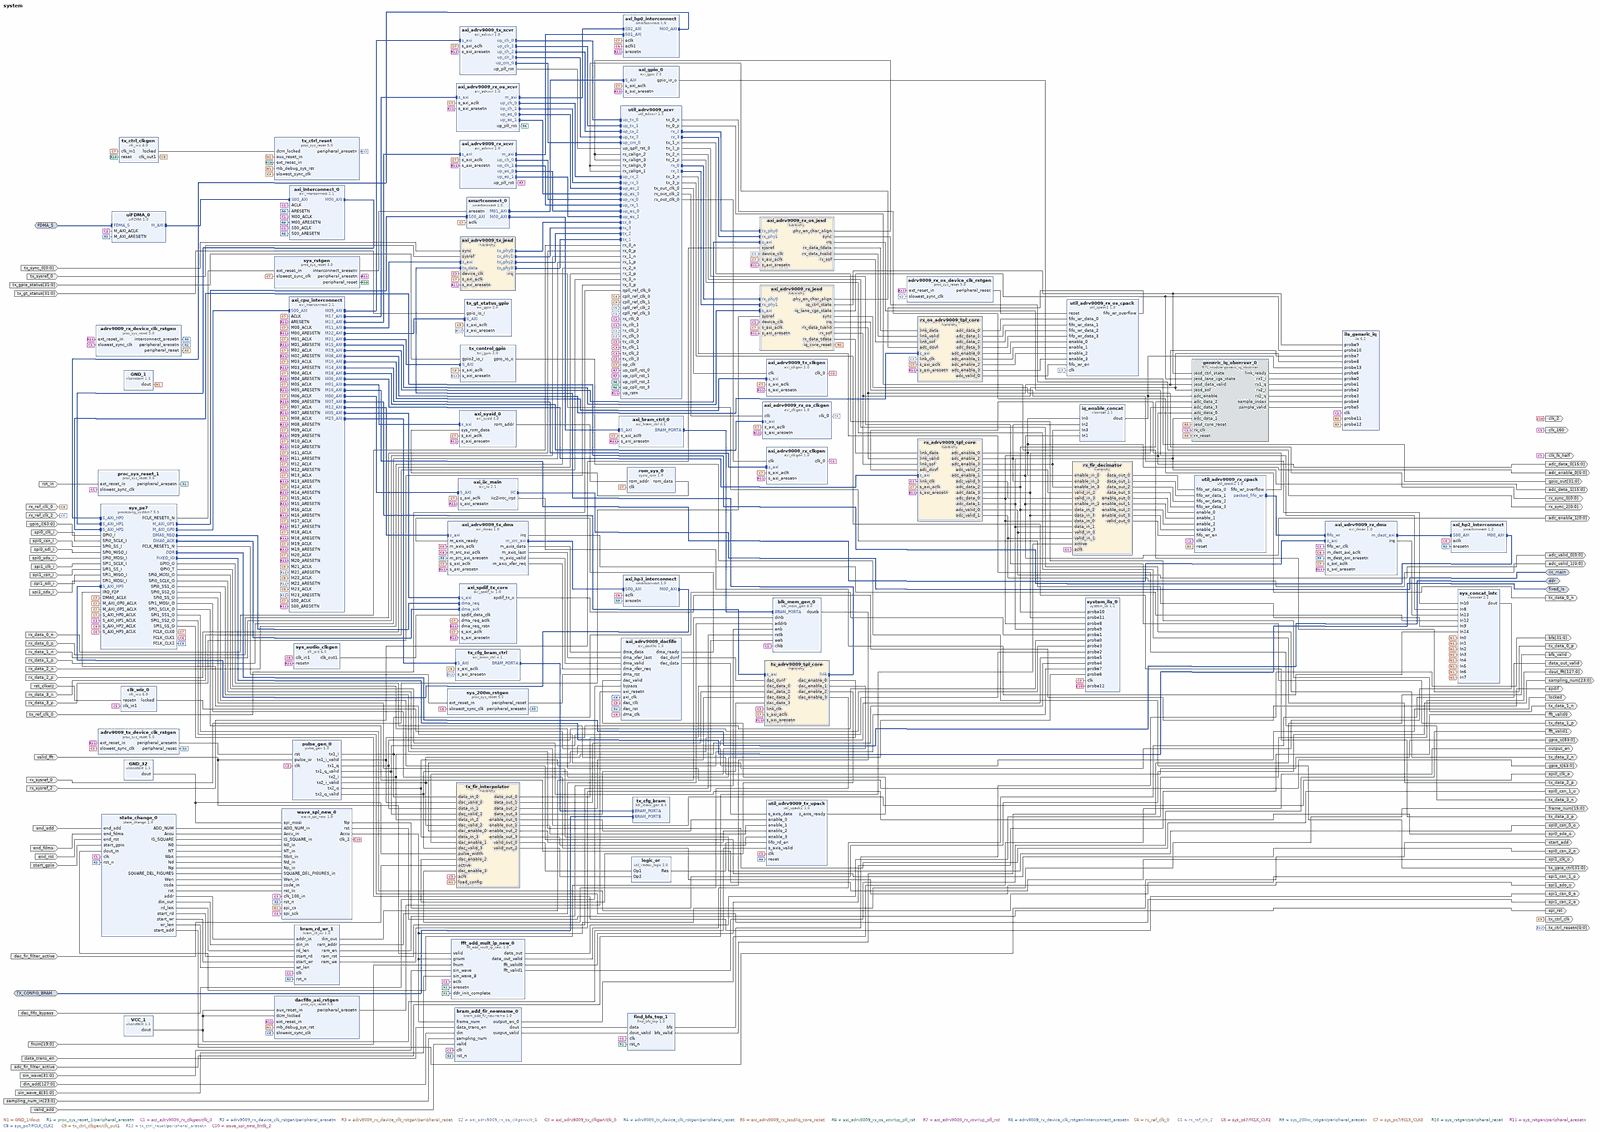
[diagram p0: block diagram of the top level, whole]
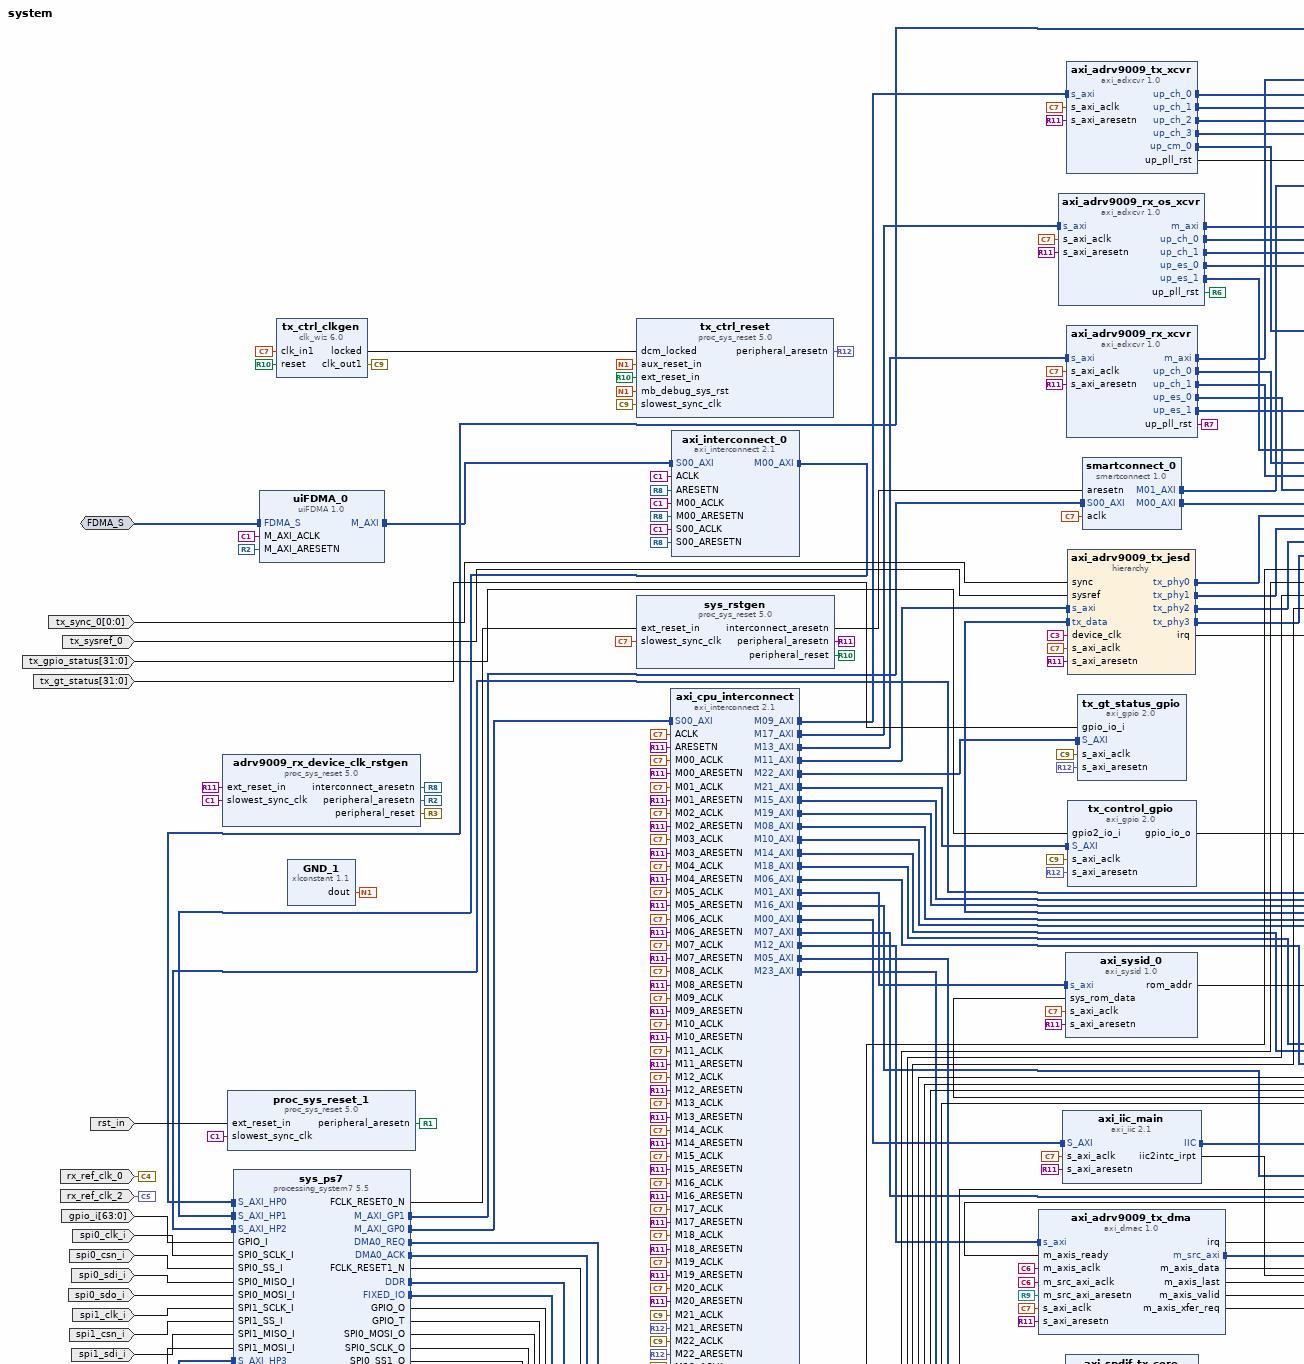
[diagram p1: block diagram of the top level, upper left part]
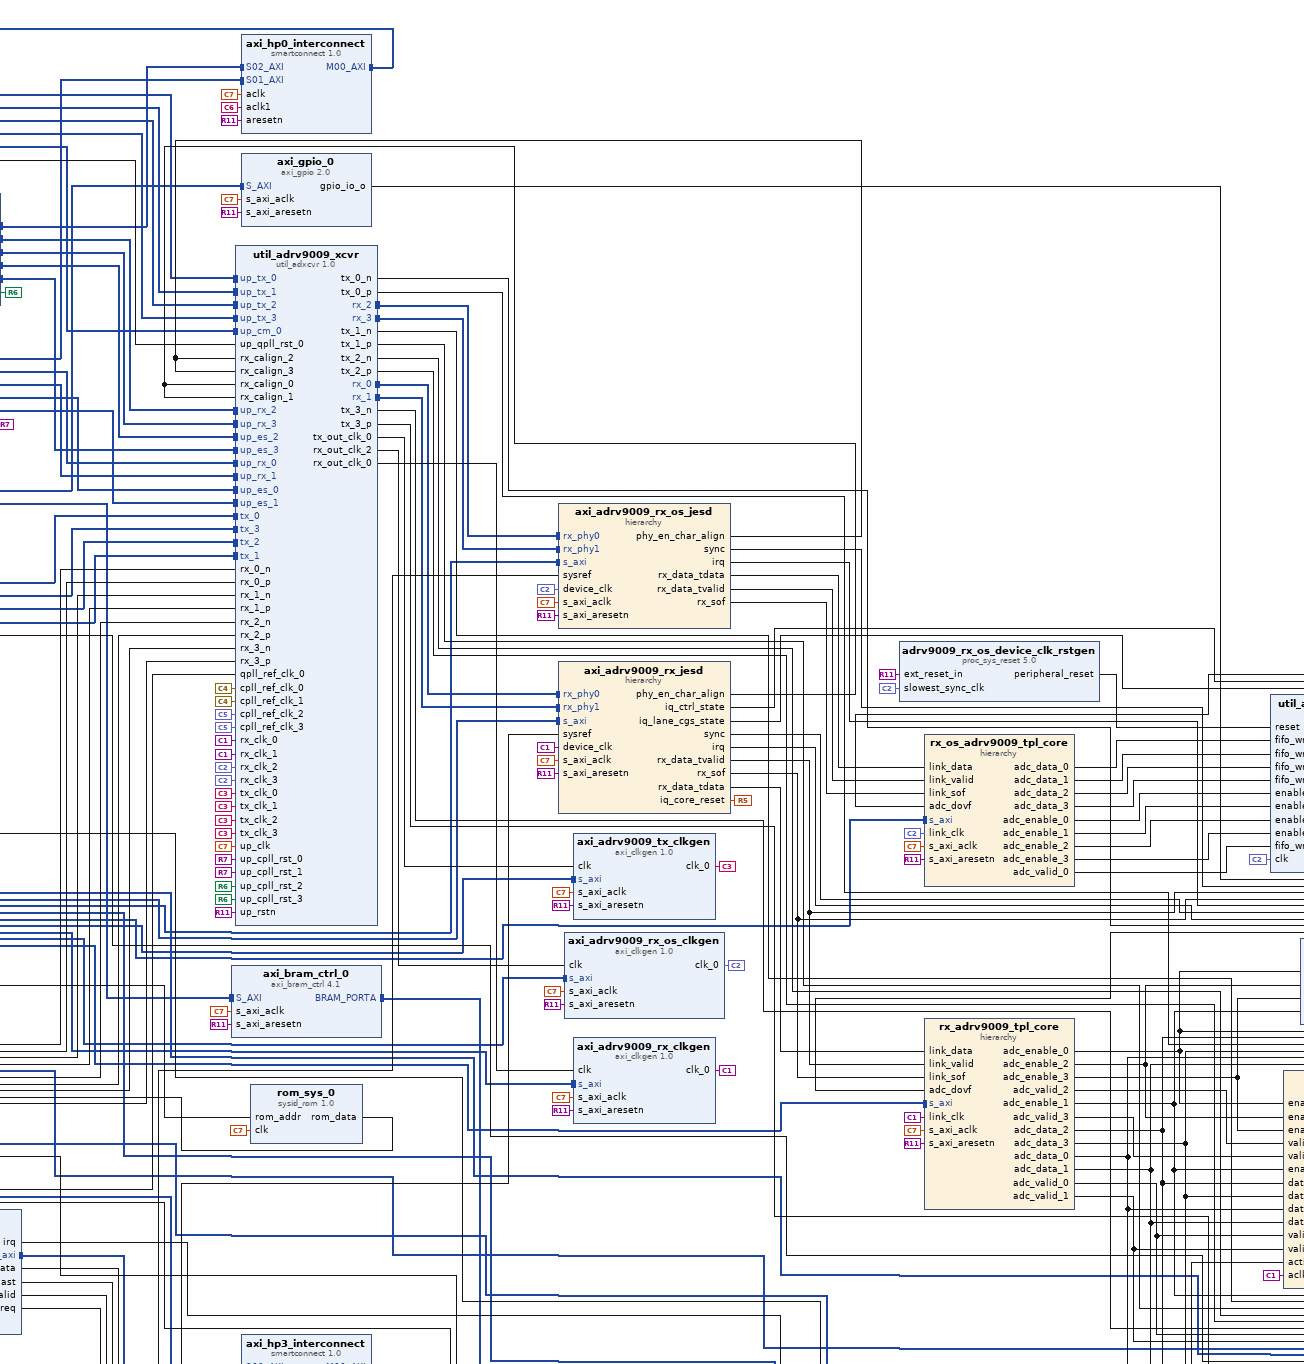
[diagram p2: block diagram of the top level, upper centre part]
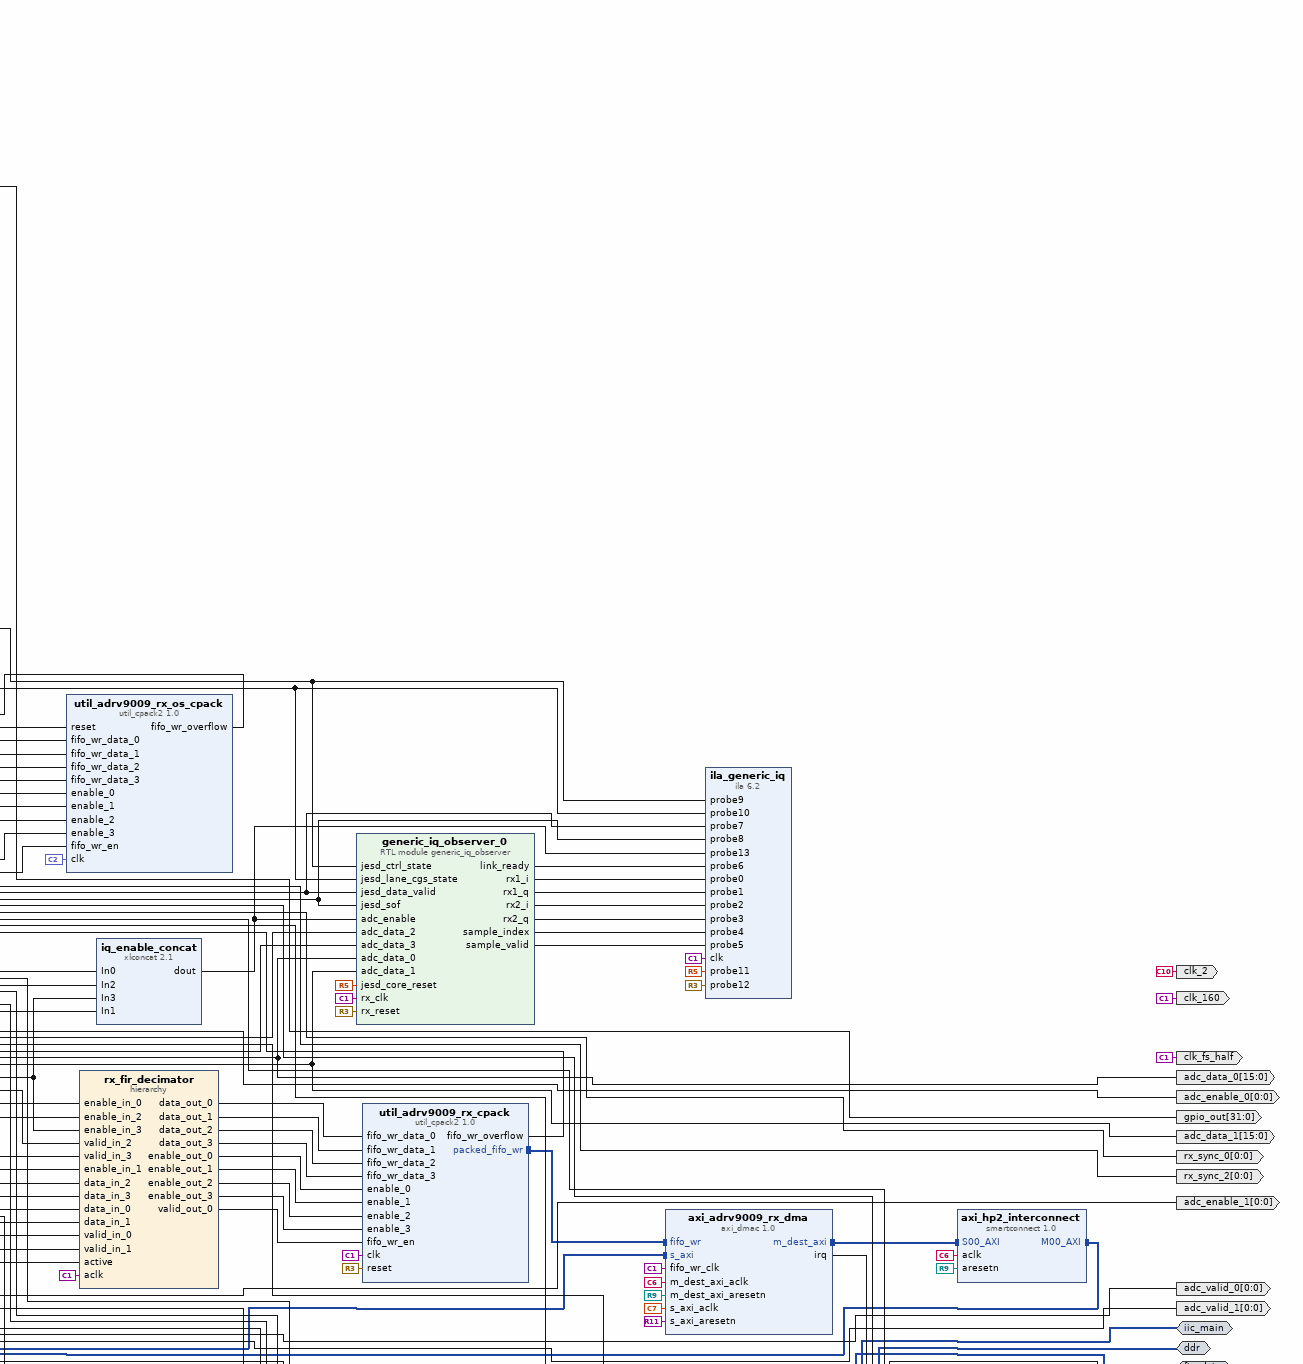
[diagram p3: block diagram of the top level, upper right part]
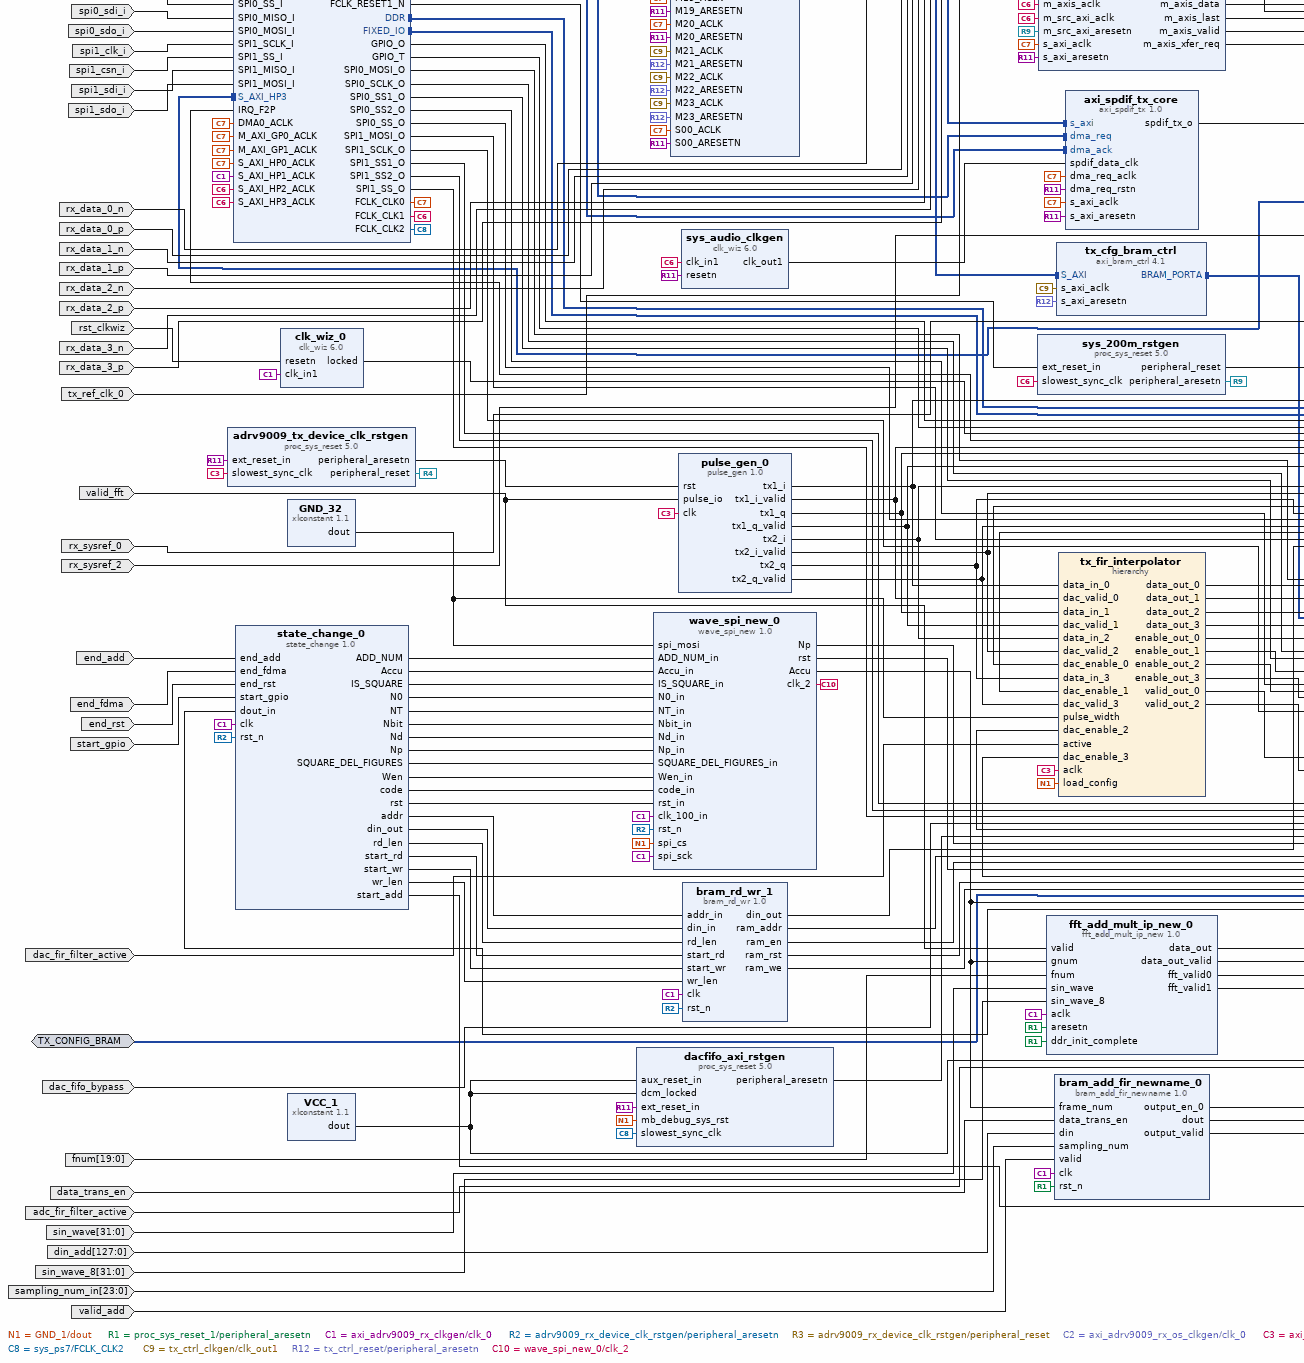
[diagram p4: block diagram of the top level, lower left part]
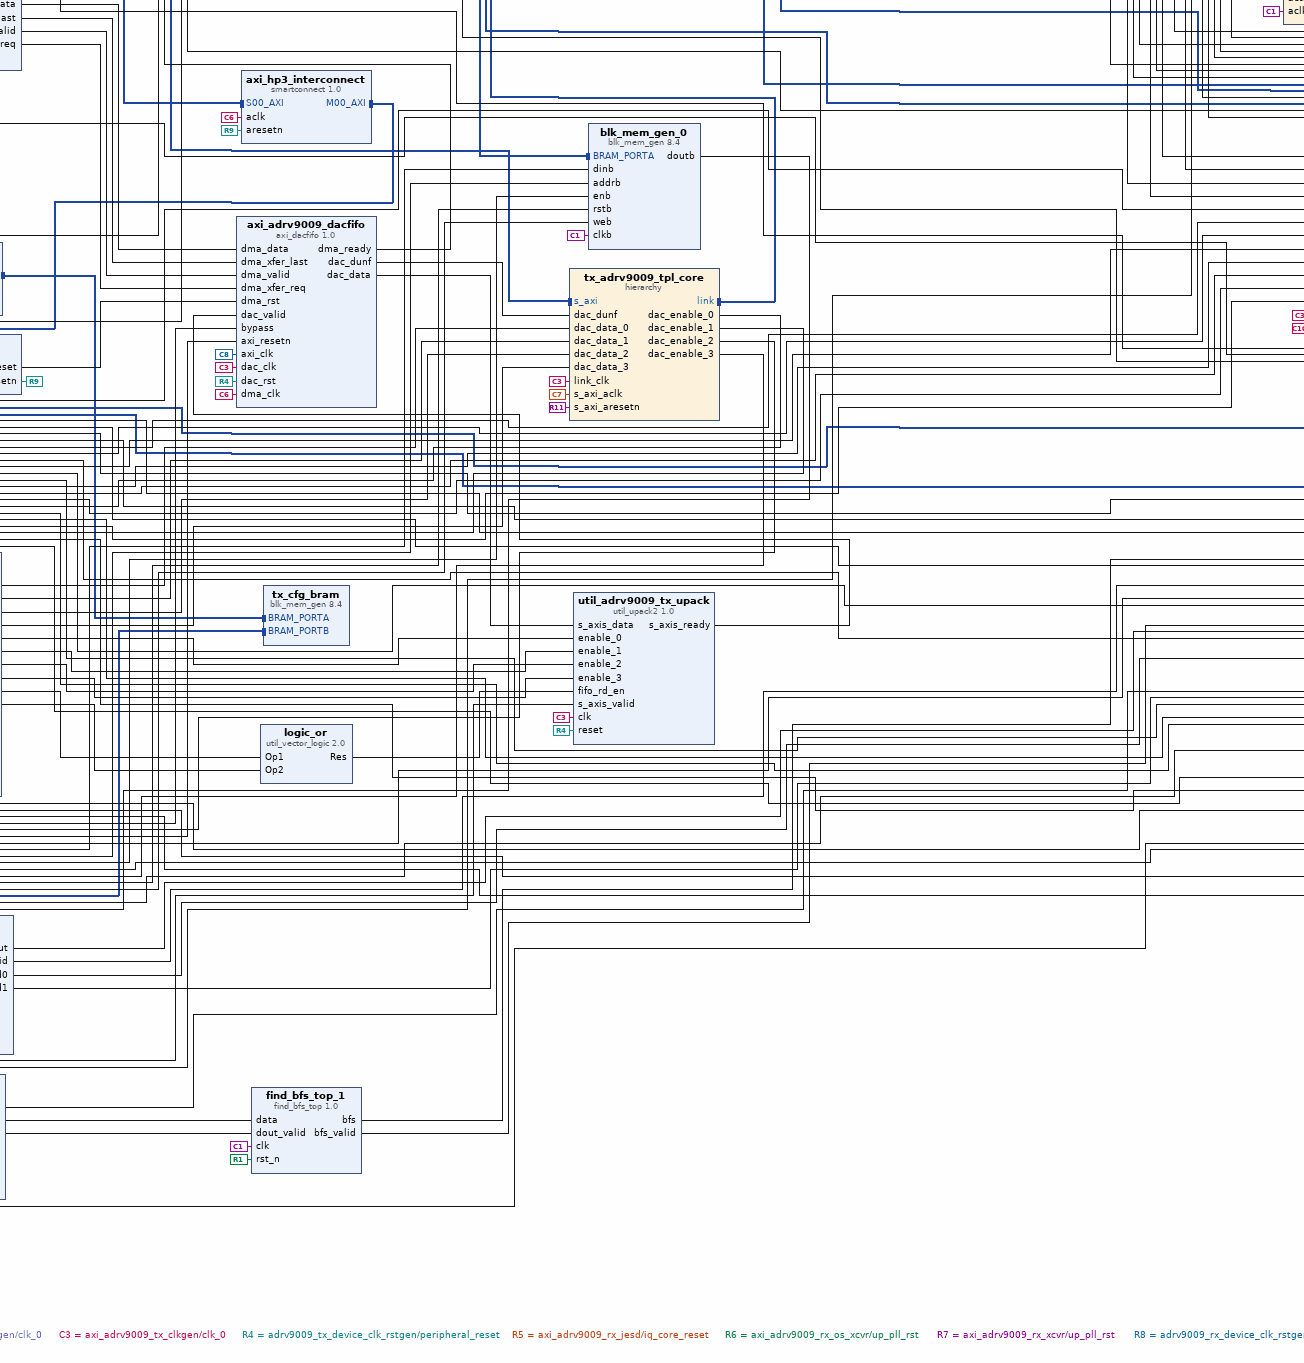
[diagram p5: block diagram of the top level, lower centre part]
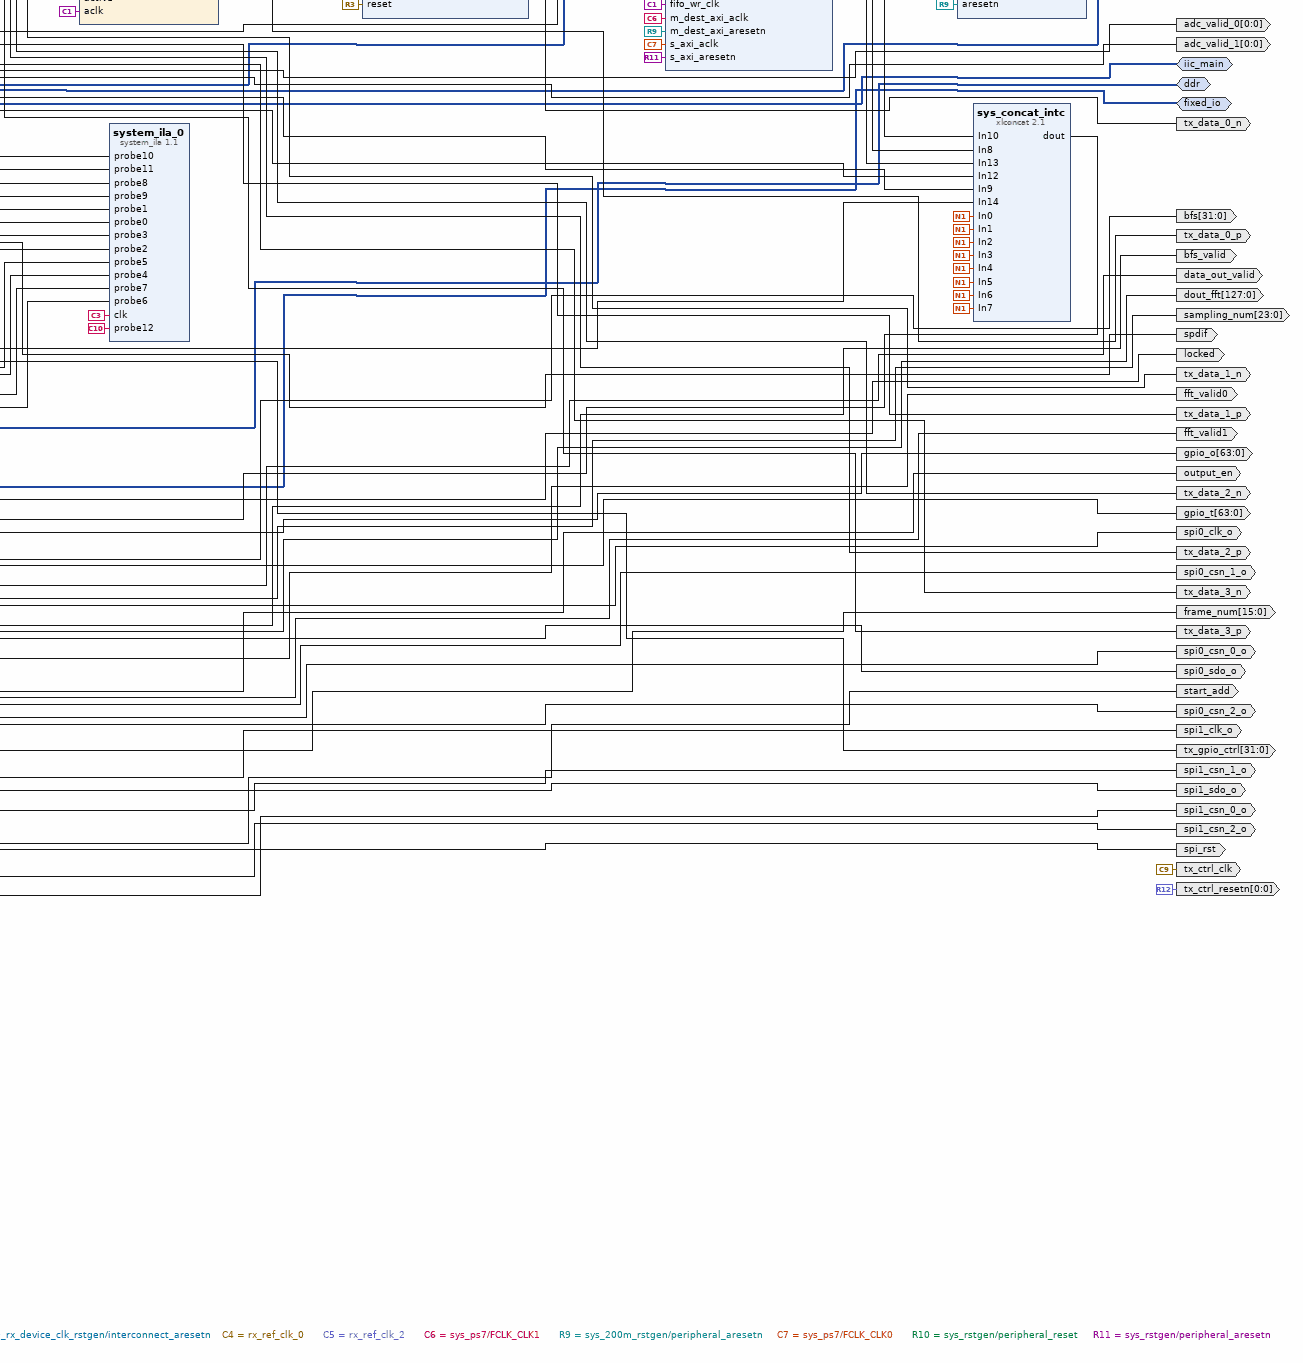
[diagram p6: block diagram of the top level, lower right part]
# Vivado block design system, xc7z100ffg900-2, Vivado 2022.2
create_bd_design system

create_bd_intf_port -mode Master -vlnv xilinx.com:interface:ddrx_rtl:1.0 ddr
create_bd_intf_port -mode Master -vlnv xilinx.com:interface:iic_rtl:1.0 iic_main
create_bd_intf_port -mode Master -vlnv xilinx.com:display_processing_system7:fixedio_rtl:1.0 fixed_io
create_bd_intf_port -mode Slave -vlnv xilinx.com:user:FDMA_rtl:1.0 FDMA_S
create_bd_intf_port -mode Slave -vlnv xilinx.com:interface:bram_rtl:1.0 TX_CONFIG_BRAM
set_property -dict {CONFIG.MASTER_TYPE BRAM_CTRL} [get_bd_intf_ports TX_CONFIG_BRAM]
create_bd_port -dir O spi0_csn_2_o
create_bd_port -dir O spi0_csn_1_o
create_bd_port -dir O spi0_csn_0_o
create_bd_port -dir I spi0_csn_i
create_bd_port -dir I spi0_clk_i
create_bd_port -dir O spi0_clk_o
create_bd_port -dir I spi0_sdo_i
create_bd_port -dir O spi0_sdo_o
create_bd_port -dir I spi0_sdi_i
create_bd_port -dir O spi1_csn_2_o
create_bd_port -dir O spi1_csn_1_o
create_bd_port -dir O spi1_csn_0_o
create_bd_port -dir I spi1_csn_i
create_bd_port -dir I spi1_clk_i
create_bd_port -dir O spi1_clk_o
create_bd_port -dir I spi1_sdo_i
create_bd_port -dir O spi1_sdo_o
create_bd_port -dir I spi1_sdi_i
create_bd_port -dir I -from 63 -to 0 gpio_i
create_bd_port -dir O -from 63 -to 0 gpio_o
create_bd_port -dir O -from 63 -to 0 gpio_t
create_bd_port -dir I adc_fir_filter_active
create_bd_port -dir I dac_fir_filter_active
create_bd_port -dir I tx_ref_clk_0
create_bd_port -dir I rx_ref_clk_0
create_bd_port -dir I rx_ref_clk_2
create_bd_port -dir I tx_sysref_0
create_bd_port -dir I -from 0 -to 0 tx_sync_0
create_bd_port -dir O tx_data_0_p
create_bd_port -dir O tx_data_0_n
create_bd_port -dir O tx_data_1_p
create_bd_port -dir O tx_data_1_n
create_bd_port -dir O tx_data_2_p
create_bd_port -dir O tx_data_2_n
create_bd_port -dir O tx_data_3_p
create_bd_port -dir O tx_data_3_n
create_bd_port -dir I rx_sysref_0
create_bd_port -dir O -from 0 -to 0 rx_sync_0
create_bd_port -dir I rx_data_0_p
create_bd_port -dir I rx_data_0_n
create_bd_port -dir I rx_data_1_p
create_bd_port -dir I rx_data_1_n
create_bd_port -dir I rx_sysref_2
create_bd_port -dir O -from 0 -to 0 rx_sync_2
create_bd_port -dir I rx_data_2_p
create_bd_port -dir I rx_data_2_n
create_bd_port -dir I rx_data_3_p
create_bd_port -dir I rx_data_3_n
create_bd_port -dir O spdif
create_bd_port -dir I -type rst rst_clkwiz
set_property -dict {CONFIG.POLARITY ACTIVE_LOW} [get_bd_ports rst_clkwiz]
create_bd_port -dir O -type rst spi_rst
create_bd_port -dir O -from 23 -to 0 sampling_num
create_bd_port -dir O -type clk clk_fs_half
set_property -dict {CONFIG.ASSOCIATED_RESET rst_clkwiz CONFIG.FREQ_HZ 100000000} [get_bd_ports clk_fs_half]
create_bd_port -dir O -type clk clk_160
create_bd_port -dir I valid_fft
create_bd_port -dir I -from 31 -to 0 sin_wave
create_bd_port -dir O fft_valid0
create_bd_port -dir O fft_valid1
create_bd_port -dir O locked
create_bd_port -dir I dac_fifo_bypass
create_bd_port -dir O clk_2
create_bd_port -dir O -from 15 -to 0 frame_num
create_bd_port -dir O -from 15 -to 0 adc_data_0
create_bd_port -dir O -from 15 -to 0 adc_data_1
create_bd_port -dir O -from 0 -to 0 adc_enable_0
create_bd_port -dir O -from 0 -to 0 adc_valid_0
create_bd_port -dir O -from 0 -to 0 adc_enable_1
create_bd_port -dir O -from 0 -to 0 adc_valid_1
create_bd_port -dir I end_add
create_bd_port -dir I end_fdma
create_bd_port -dir O start_add
create_bd_port -dir I -from 127 -to 0 din_add
create_bd_port -dir I valid_add
create_bd_port -dir O data_out_valid
create_bd_port -dir O -from 127 -to 0 dout_fft
create_bd_port -dir I -from 19 -to 0 fnum
create_bd_port -dir I data_trans_en
create_bd_port -dir I -type rst rst_in
create_bd_port -dir O -from 31 -to 0 gpio_out
create_bd_port -dir I start_gpio
create_bd_port -dir I -type rst end_rst
create_bd_port -dir I -from 31 -to 0 sin_wave_8
create_bd_port -dir O output_en
create_bd_port -dir O -from 31 -to 0 bfs
create_bd_port -dir O bfs_valid
create_bd_port -dir I -from 23 -to 0 sampling_num_in
create_bd_port -dir O -type clk tx_ctrl_clk
set_property -dict {CONFIG.FREQ_HZ 50000000} [get_bd_ports tx_ctrl_clk]
create_bd_port -dir O -from 0 -to 0 -type rst tx_ctrl_resetn
set_property -dict {CONFIG.POLARITY ACTIVE_LOW} [get_bd_ports tx_ctrl_resetn]
create_bd_port -dir O -from 31 -to 0 tx_gpio_ctrl
create_bd_port -dir I -from 31 -to 0 tx_gpio_status
create_bd_port -dir I -from 31 -to 0 tx_gt_status

create_bd_cell -type hier axi_adrv9009_tx_jesd
create_bd_cell -type hier tx_fir_interpolator
create_bd_cell -type hier tx_adrv9009_tpl_core
create_bd_cell -type hier axi_adrv9009_rx_jesd
create_bd_cell -type hier rx_adrv9009_tpl_core
create_bd_cell -type hier rx_fir_decimator
create_bd_cell -type hier axi_adrv9009_rx_os_jesd
create_bd_cell -type hier rx_os_adrv9009_tpl_core
create_bd_cell -type ip -vlnv xilinx.com:ip:proc_sys_reset:5.0 adrv9009_rx_device_clk_rstgen
create_bd_cell -type ip -vlnv xilinx.com:ip:proc_sys_reset:5.0 adrv9009_rx_os_device_clk_rstgen
create_bd_cell -type ip -vlnv xilinx.com:ip:proc_sys_reset:5.0 adrv9009_tx_device_clk_rstgen
create_bd_cell -type ip -vlnv analog.com:user:axi_adxcvr:1.0 axi_adrv9009_rx_os_xcvr
set_property -dict [list \
  CONFIG.DEV_PACKAGE 3 \
  CONFIG.FPGA_FAMILY 4 \
  CONFIG.FPGA_TECHNOLOGY 1 \
  CONFIG.FPGA_VOLTAGE 970 \
  CONFIG.NUM_OF_LANES 2 \
  CONFIG.OUT_CLK_SEL {"011"} \
  CONFIG.QPLL_ENABLE 0 \
  CONFIG.SPEED_GRADE 20 \
  CONFIG.SYS_CLK_SEL 00 \
  CONFIG.TX_OR_RX_N 0 \
  CONFIG.XCVR_TYPE 2 \
] [get_bd_cells axi_adrv9009_rx_os_xcvr]
create_bd_cell -type ip -vlnv analog.com:user:axi_adxcvr:1.0 axi_adrv9009_rx_xcvr
set_property -dict [list \
  CONFIG.DEV_PACKAGE 3 \
  CONFIG.FPGA_FAMILY 4 \
  CONFIG.FPGA_TECHNOLOGY 1 \
  CONFIG.FPGA_VOLTAGE 970 \
  CONFIG.NUM_OF_LANES 2 \
  CONFIG.OUT_CLK_SEL {"011"} \
  CONFIG.QPLL_ENABLE 0 \
  CONFIG.SPEED_GRADE 20 \
  CONFIG.SYS_CLK_SEL 00 \
  CONFIG.TX_OR_RX_N 0 \
  CONFIG.XCVR_TYPE 2 \
] [get_bd_cells axi_adrv9009_rx_xcvr]
create_bd_cell -type ip -vlnv analog.com:user:axi_adxcvr:1.0 axi_adrv9009_tx_xcvr
set_property -dict [list \
  CONFIG.DEV_PACKAGE 3 \
  CONFIG.FPGA_FAMILY 4 \
  CONFIG.FPGA_TECHNOLOGY 1 \
  CONFIG.FPGA_VOLTAGE 970 \
  CONFIG.NUM_OF_LANES 4 \
  CONFIG.OUT_CLK_SEL {"011"} \
  CONFIG.QPLL_ENABLE 1 \
  CONFIG.SPEED_GRADE 20 \
  CONFIG.SYS_CLK_SEL {"11"} \
  CONFIG.TX_OR_RX_N 1 \
  CONFIG.XCVR_TYPE 2 \
] [get_bd_cells axi_adrv9009_tx_xcvr]
create_bd_cell -type ip -vlnv analog.com:user:sysid_rom:1.0 rom_sys_0
set_property -dict {CONFIG.PATH_TO_FILE mem_init_sys.txt CONFIG.ROM_ADDR_BITS 9} [get_bd_cells rom_sys_0]
create_bd_cell -type ip -vlnv xilinx.com:ip:proc_sys_reset:5.0 sys_200m_rstgen
set_property -dict {CONFIG.C_EXT_RST_WIDTH 1} [get_bd_cells sys_200m_rstgen]
create_bd_cell -type ip -vlnv xilinx.com:ip:processing_system7:5.5 sys_ps7
set_property -dict [list \
  CONFIG.PCW_APU_PERIPHERAL_FREQMHZ 667.000000 \
  CONFIG.PCW_CPU_CPU_6X4X_MAX_RANGE 800 \
  CONFIG.PCW_ENET0_ENET0_IO {MIO 16 .. 27} \
  CONFIG.PCW_ENET0_GRP_MDIO_ENABLE 1 \
  CONFIG.PCW_ENET0_GRP_MDIO_IO {MIO 52 .. 53} \
  CONFIG.PCW_ENET0_PERIPHERAL_ENABLE 1 \
  CONFIG.PCW_ENET0_PERIPHERAL_FREQMHZ {100 Mbps} \
  CONFIG.PCW_ENET0_RESET_ENABLE 1 \
  CONFIG.PCW_ENET0_RESET_IO {MIO 47} \
  CONFIG.PCW_ENET_RESET_ENABLE 1 \
  CONFIG.PCW_ENET_RESET_SELECT {Share reset pin} \
  CONFIG.PCW_EN_CLK1_PORT 1 \
  CONFIG.PCW_EN_CLK2_PORT 1 \
  CONFIG.PCW_EN_RST1_PORT 1 \
  CONFIG.PCW_EN_RST2_PORT 1 \
  CONFIG.PCW_FCLK_CLK1_BUF TRUE \
  CONFIG.PCW_FCLK_CLK2_BUF TRUE \
  CONFIG.PCW_FPGA0_PERIPHERAL_FREQMHZ 100.0 \
  CONFIG.PCW_FPGA1_PERIPHERAL_FREQMHZ 200.0 \
  CONFIG.PCW_FPGA2_PERIPHERAL_FREQMHZ 250 \
  CONFIG.PCW_FPGA_FCLK1_ENABLE 1 \
  CONFIG.PCW_FPGA_FCLK2_ENABLE 1 \
  CONFIG.PCW_GPIO_EMIO_GPIO_ENABLE 1 \
  CONFIG.PCW_GPIO_EMIO_GPIO_IO 64 \
  CONFIG.PCW_GPIO_MIO_GPIO_ENABLE 1 \
  CONFIG.PCW_GPIO_MIO_GPIO_IO MIO \
  CONFIG.PCW_I2C0_GRP_INT_ENABLE 0 \
  CONFIG.PCW_I2C0_I2C0_IO {MIO 50 .. 51} \
  CONFIG.PCW_I2C0_PERIPHERAL_ENABLE 1 \
  CONFIG.PCW_I2C0_RESET_ENABLE 1 \
  CONFIG.PCW_I2C0_RESET_IO {MIO 46} \
  CONFIG.PCW_I2C_PERIPHERAL_FREQMHZ 111.111115 \
  CONFIG.PCW_I2C_RESET_ENABLE 1 \
  CONFIG.PCW_I2C_RESET_SELECT {Share reset pin} \
  CONFIG.PCW_IRQ_F2P_INTR 1 \
  CONFIG.PCW_IRQ_F2P_MODE REVERSE \
  CONFIG.PCW_PERIPHERAL_BOARD_PRESET part0 \
  CONFIG.PCW_PRESET_BANK0_VOLTAGE {LVCMOS 1.8V} \
  CONFIG.PCW_PRESET_BANK1_VOLTAGE {LVCMOS 1.8V} \
  CONFIG.PCW_QSPI_INTERNAL_HIGHADDRESS 0xFDFFFFFF \
  CONFIG.PCW_QSPI_PERIPHERAL_ENABLE 0 \
  CONFIG.PCW_SD0_GRP_CD_ENABLE 0 \
  CONFIG.PCW_SD0_GRP_WP_ENABLE 1 \
  CONFIG.PCW_SD0_GRP_WP_IO EMIO \
  CONFIG.PCW_SD0_PERIPHERAL_ENABLE 1 \
  CONFIG.PCW_SD0_SD0_IO {MIO 40 .. 45} \
  CONFIG.PCW_SDIO_PERIPHERAL_FREQMHZ 50 \
  CONFIG.PCW_SPI0_PERIPHERAL_ENABLE 1 \
  CONFIG.PCW_SPI0_SPI0_IO EMIO \
  CONFIG.PCW_SPI1_PERIPHERAL_ENABLE 1 \
  CONFIG.PCW_SPI1_SPI1_IO EMIO \
  CONFIG.PCW_UART1_PERIPHERAL_ENABLE 1 \
  CONFIG.PCW_UART1_UART1_IO {MIO 48 .. 49} \
  CONFIG.PCW_UART_PERIPHERAL_FREQMHZ 50 \
  CONFIG.PCW_UIPARAM_DDR_FREQ_MHZ 533.333313 \
  CONFIG.PCW_UIPARAM_DDR_PARTNO Custom \
  CONFIG.PCW_USB0_PERIPHERAL_ENABLE 1 \
  CONFIG.PCW_USB0_RESET_ENABLE 1 \
  CONFIG.PCW_USB0_RESET_IO {MIO 7} \
  CONFIG.PCW_USB0_USB0_IO {MIO 28 .. 39} \
  CONFIG.PCW_USB_RESET_ENABLE 1 \
  CONFIG.PCW_USB_RESET_SELECT {Share reset pin} \
  CONFIG.PCW_USE_DMA0 1 \
  CONFIG.PCW_USE_FABRIC_INTERRUPT 1 \
  CONFIG.PCW_USE_M_AXI_GP1 1 \
  CONFIG.PCW_USE_S_AXI_HP0 1 \
  CONFIG.PCW_USE_S_AXI_HP1 1 \
  CONFIG.PCW_USE_S_AXI_HP2 1 \
  CONFIG.PCW_USE_S_AXI_HP3 1 \
  CONFIG.preset ZC706 \
] [get_bd_cells sys_ps7]
# 532 more settings of sys_ps7 are not shown: defaults, MIO pin electricals, DDR timing, and values the tool derives
create_bd_cell -type ip -vlnv xilinx.com:ip:proc_sys_reset:5.0 sys_rstgen
set_property -dict {CONFIG.C_EXT_RST_WIDTH 1} [get_bd_cells sys_rstgen]
create_bd_cell -type ip -vlnv analog.com:user:util_cpack2:1.0 util_adrv9009_rx_cpack
set_property -dict [list \
  CONFIG.NUM_OF_CHANNELS 4 \
  CONFIG.SAMPLES_PER_CHANNEL 1 \
  CONFIG.SAMPLE_DATA_WIDTH 16 \
] [get_bd_cells util_adrv9009_rx_cpack]
create_bd_cell -type ip -vlnv analog.com:user:util_cpack2:1.0 util_adrv9009_rx_os_cpack
set_property -dict [list \
  CONFIG.NUM_OF_CHANNELS 4 \
  CONFIG.SAMPLES_PER_CHANNEL 1 \
  CONFIG.SAMPLE_DATA_WIDTH 16 \
] [get_bd_cells util_adrv9009_rx_os_cpack]
create_bd_cell -type ip -vlnv analog.com:user:util_upack2:1.0 util_adrv9009_tx_upack
set_property -dict [list \
  CONFIG.NUM_OF_CHANNELS 4 \
  CONFIG.SAMPLES_PER_CHANNEL 2 \
  CONFIG.SAMPLE_DATA_WIDTH 16 \
] [get_bd_cells util_adrv9009_tx_upack]
create_bd_cell -type ip -vlnv analog.com:user:axi_spdif_tx:1.0 axi_spdif_tx_core
set_property -dict {CONFIG.DMA_TYPE 1 CONFIG.S_AXI_ADDRESS_WIDTH 16} [get_bd_cells axi_spdif_tx_core]
create_bd_cell -type ip -vlnv analog.com:user:axi_sysid:1.0 axi_sysid_0
set_property -dict {CONFIG.ROM_ADDR_BITS 9} [get_bd_cells axi_sysid_0]
create_bd_cell -type ip -vlnv analog.com:user:util_adxcvr:1.0 util_adrv9009_xcvr
set_property -dict [list \
  CONFIG.CPLL_FBDIV 4 \
  CONFIG.CPLL_FBDIV_4_5 5 \
  CONFIG.QPLL_FBDIV 0x080 \
  CONFIG.RX_CDR_CFG 0x0b000023ff10400020 \
  CONFIG.RX_CLK25_DIV 10 \
  CONFIG.RX_NUM_OF_LANES 4 \
  CONFIG.RX_PMA_CFG 0x001E7080 \
  CONFIG.TX_CLK25_DIV 10 \
  CONFIG.TX_NUM_OF_LANES 4 \
  CONFIG.TX_OUT_DIV 1 \
  CONFIG.XCVR_TYPE 2 \
] [get_bd_cells util_adrv9009_xcvr]
create_bd_cell -type ip -vlnv xilinx.com:ip:xlconcat:2.1 sys_concat_intc
set_property -dict {CONFIG.NUM_PORTS 16 CONFIG.dout_width 16} [get_bd_cells sys_concat_intc]
create_bd_cell -type ip -vlnv analog.com:user:axi_dmac:1.0 axi_adrv9009_rx_dma
set_property -dict [list \
  CONFIG.ALLOW_ASYM_MEM 1 \
  CONFIG.ASYNC_CLK_DEST_REQ true \
  CONFIG.ASYNC_CLK_REQ_SRC true \
  CONFIG.ASYNC_CLK_SRC_DEST true \
  CONFIG.AXI_SLICE_DEST true \
  CONFIG.AXI_SLICE_SRC true \
  CONFIG.CYCLIC false \
  CONFIG.DMA_2D_TRANSFER false \
  CONFIG.DMA_AXI_PROTOCOL_DEST 1 \
  CONFIG.DMA_DATA_WIDTH_SRC 64 \
  CONFIG.DMA_TYPE_DEST 0 \
  CONFIG.DMA_TYPE_SRC 2 \
  CONFIG.MAX_BYTES_PER_BURST 256 \
  CONFIG.SYNC_TRANSFER_START true \
] [get_bd_cells axi_adrv9009_rx_dma]
create_bd_cell -type ip -vlnv analog.com:user:axi_dmac:1.0 axi_adrv9009_tx_dma
set_property -dict [list \
  CONFIG.ALLOW_ASYM_MEM 1 \
  CONFIG.ASYNC_CLK_DEST_REQ true \
  CONFIG.ASYNC_CLK_REQ_SRC true \
  CONFIG.ASYNC_CLK_SRC_DEST true \
  CONFIG.AXI_SLICE_DEST true \
  CONFIG.AXI_SLICE_SRC true \
  CONFIG.CYCLIC true \
  CONFIG.DMA_2D_TRANSFER false \
  CONFIG.DMA_AXI_PROTOCOL_SRC 1 \
  CONFIG.DMA_DATA_WIDTH_DEST 128 \
  CONFIG.DMA_TYPE_DEST 1 \
  CONFIG.DMA_TYPE_SRC 0 \
  CONFIG.MAX_BYTES_PER_BURST 256 \
] [get_bd_cells axi_adrv9009_tx_dma]
create_bd_cell -type ip -vlnv xilinx.com:user:uiFDMA:1.0 uiFDMA_0
set_property -dict {CONFIG.M_AXI_DATA_WIDTH 32 CONFIG.M_AXI_ID_WIDTH 1 CONFIG.M_AXI_MAX_BURST_LEN 256} [get_bd_cells uiFDMA_0]
create_bd_cell -type ip -vlnv analog.com:user:axi_dacfifo:1.0 axi_adrv9009_dacfifo
set_property -dict [list \
  CONFIG.AXI_ADDRESS 0x80000000 \
  CONFIG.AXI_ADDRESS_LIMIT 0xbfffffff \
  CONFIG.AXI_LENGTH 255 \
  CONFIG.AXI_SIZE 6 \
  CONFIG.DAC_DATA_WIDTH 128 \
  CONFIG.DMA_DATA_WIDTH 128 \
] [get_bd_cells axi_adrv9009_dacfifo]
create_bd_cell -type ip -vlnv analog.com:user:axi_clkgen:1.0 axi_adrv9009_rx_clkgen
set_property -dict [list \
  CONFIG.CLK0_DIV 4 \
  CONFIG.CLKIN_PERIOD 4 \
  CONFIG.DEV_PACKAGE 3 \
  CONFIG.ENABLE_CLKOUT1 false \
  CONFIG.FPGA_FAMILY 4 \
  CONFIG.FPGA_TECHNOLOGY 1 \
  CONFIG.FPGA_VOLTAGE 970 \
  CONFIG.ID 2 \
  CONFIG.SPEED_GRADE 20 \
  CONFIG.VCO_DIV 1 \
  CONFIG.VCO_MUL 4 \
] [get_bd_cells axi_adrv9009_rx_clkgen]
create_bd_cell -type ip -vlnv analog.com:user:axi_clkgen:1.0 axi_adrv9009_rx_os_clkgen
set_property -dict [list \
  CONFIG.CLK0_DIV 3 \
  CONFIG.CLKIN_PERIOD 4 \
  CONFIG.DEV_PACKAGE 3 \
  CONFIG.FPGA_FAMILY 4 \
  CONFIG.FPGA_TECHNOLOGY 1 \
  CONFIG.FPGA_VOLTAGE 970 \
  CONFIG.ID 2 \
  CONFIG.SPEED_GRADE 20 \
  CONFIG.VCO_DIV 1 \
  CONFIG.VCO_MUL 3 \
] [get_bd_cells axi_adrv9009_rx_os_clkgen]
create_bd_cell -type ip -vlnv analog.com:user:axi_clkgen:1.0 axi_adrv9009_tx_clkgen
set_property -dict [list \
  CONFIG.CLK0_DIV 4 \
  CONFIG.CLKIN_PERIOD 4 \
  CONFIG.DEV_PACKAGE 3 \
  CONFIG.FPGA_FAMILY 4 \
  CONFIG.FPGA_TECHNOLOGY 1 \
  CONFIG.FPGA_VOLTAGE 970 \
  CONFIG.ID 2 \
  CONFIG.SPEED_GRADE 20 \
  CONFIG.VCO_DIV 1 \
  CONFIG.VCO_MUL 4 \
] [get_bd_cells axi_adrv9009_tx_clkgen]
create_bd_cell -type ip -vlnv xilinx.com:ip:proc_sys_reset:5.0 proc_sys_reset_1
create_bd_cell -type ip -vlnv xilinx.com:user:state_change:1.0 state_change_0
create_bd_cell -type ip -vlnv xilinx.com:user:pulse_gen:1.0 pulse_gen_0
create_bd_cell -type ip -vlnv xilinx.com:user:bram_rd_wr:1.0 bram_rd_wr_1
create_bd_cell -type ip -vlnv xilinx.com:ip:xlconstant:1.1 GND_1
set_property -dict {CONFIG.CONST_VAL 0 CONFIG.CONST_WIDTH 1} [get_bd_cells GND_1]
create_bd_cell -type ip -vlnv xilinx.com:ip:xlconstant:1.1 GND_32
set_property -dict {CONFIG.CONST_VAL 0 CONFIG.CONST_WIDTH 32} [get_bd_cells GND_32]
create_bd_cell -type ip -vlnv xilinx.com:ip:xlconstant:1.1 VCC_1
set_property -dict {CONFIG.CONST_VAL 1 CONFIG.CONST_WIDTH 1} [get_bd_cells VCC_1]
create_bd_cell -type ip -vlnv xilinx.com:ip:axi_bram_ctrl:4.1 axi_bram_ctrl_0
set_property -dict {CONFIG.SINGLE_PORT_BRAM 1} [get_bd_cells axi_bram_ctrl_0]
create_bd_cell -type ip -vlnv xilinx.com:ip:axi_interconnect:2.1 axi_cpu_interconnect
set_property -dict {CONFIG.NUM_MI 24} [get_bd_cells axi_cpu_interconnect]
create_bd_cell -type ip -vlnv xilinx.com:ip:axi_gpio:2.0 axi_gpio_0
create_bd_cell -type ip -vlnv xilinx.com:ip:smartconnect:1.0 axi_hp0_interconnect
set_property -dict {CONFIG.NUM_CLKS 2 CONFIG.NUM_MI 1 CONFIG.NUM_SI 3} [get_bd_cells axi_hp0_interconnect]
create_bd_cell -type ip -vlnv xilinx.com:ip:smartconnect:1.0 axi_hp2_interconnect
set_property -dict {CONFIG.NUM_MI 1 CONFIG.NUM_SI 1} [get_bd_cells axi_hp2_interconnect]
create_bd_cell -type ip -vlnv xilinx.com:ip:smartconnect:1.0 axi_hp3_interconnect
set_property -dict {CONFIG.NUM_MI 1 CONFIG.NUM_SI 1} [get_bd_cells axi_hp3_interconnect]
create_bd_cell -type ip -vlnv xilinx.com:ip:axi_iic:2.1 axi_iic_main
set_property -dict {CONFIG.IIC_BOARD_INTERFACE Custom CONFIG.USE_BOARD_FLOW true} [get_bd_cells axi_iic_main]
create_bd_cell -type ip -vlnv xilinx.com:ip:axi_interconnect:2.1 axi_interconnect_0
set_property -dict {CONFIG.NUM_MI 1} [get_bd_cells axi_interconnect_0]
create_bd_cell -type ip -vlnv xilinx.com:ip:blk_mem_gen:8.4 blk_mem_gen_0
set_property -dict [list \
  CONFIG.EN_SAFETY_CKT false \
  CONFIG.Enable_B Use_ENB_Pin \
  CONFIG.Memory_Type True_Dual_Port_RAM \
  CONFIG.Port_B_Clock 100 \
  CONFIG.Port_B_Enable_Rate 100 \
  CONFIG.Port_B_Write_Rate 50 \
  CONFIG.Use_RSTB_Pin true \
] [get_bd_cells blk_mem_gen_0]
create_bd_cell -type ip -vlnv xilinx.com:user:bram_add_fir_newname:1.0 bram_add_fir_newname_0
create_bd_cell -type ip -vlnv xilinx.com:ip:clk_wiz:6.0 clk_wiz_0
set_property -dict [list \
  CONFIG.CLKOUT1_JITTER 114.829 \
  CONFIG.CLKOUT1_PHASE_ERROR 98.575 \
  CONFIG.CLKOUT1_REQUESTED_OUT_FREQ 200.000 \
  CONFIG.CLKOUT2_JITTER 114.829 \
  CONFIG.CLKOUT2_PHASE_ERROR 98.575 \
  CONFIG.CLKOUT2_REQUESTED_OUT_FREQ 100.000 \
  CONFIG.CLKOUT2_USED false \
  CONFIG.CLKOUT3_JITTER 110.209 \
  CONFIG.CLKOUT3_PHASE_ERROR 98.575 \
  CONFIG.CLKOUT3_REQUESTED_OUT_FREQ 100.000 \
  CONFIG.CLKOUT3_USED false \
  CONFIG.CLKOUT4_JITTER 130.958 \
  CONFIG.CLKOUT4_PHASE_ERROR 98.575 \
  CONFIG.CLKOUT4_USED false \
  CONFIG.MMCM_CLKFBOUT_MULT_F 10.000 \
  CONFIG.MMCM_CLKOUT0_DIVIDE_F 5.000 \
  CONFIG.MMCM_CLKOUT1_DIVIDE 1 \
  CONFIG.MMCM_CLKOUT2_DIVIDE 1 \
  CONFIG.MMCM_CLKOUT3_DIVIDE 1 \
  CONFIG.NUM_OUT_CLKS 1 \
  CONFIG.RESET_PORT resetn \
  CONFIG.RESET_TYPE ACTIVE_LOW \
] [get_bd_cells clk_wiz_0]
create_bd_cell -type ip -vlnv xilinx.com:user:fft_add_mult_ip_new:1.0 fft_add_mult_ip_new_0
create_bd_cell -type ip -vlnv xilinx.com:user:find_bfs_top:1.0 find_bfs_top_1
create_bd_cell -type ip -vlnv xilinx.com:ip:util_vector_logic:2.0 logic_or
set_property -dict {CONFIG.C_OPERATION or CONFIG.C_SIZE 1} [get_bd_cells logic_or]
create_bd_cell -type ip -vlnv xilinx.com:ip:smartconnect:1.0 smartconnect_0
set_property -dict {CONFIG.NUM_MI 2 CONFIG.NUM_SI 1} [get_bd_cells smartconnect_0]
create_bd_cell -type ip -vlnv xilinx.com:ip:clk_wiz:6.0 sys_audio_clkgen
set_property -dict [list \
  CONFIG.CLKIN1_JITTER_PS 50.0 \
  CONFIG.CLKOUT1_JITTER 327.996 \
  CONFIG.CLKOUT1_PHASE_ERROR 264.435 \
  CONFIG.CLKOUT1_REQUESTED_OUT_FREQ 12.288 \
  CONFIG.MMCM_CLKFBOUT_MULT_F 44.375 \
  CONFIG.MMCM_CLKIN1_PERIOD 5.000 \
  CONFIG.MMCM_CLKIN2_PERIOD 10.0 \
  CONFIG.MMCM_CLKOUT0_DIVIDE_F 80.250 \
  CONFIG.MMCM_DIVCLK_DIVIDE 9 \
  CONFIG.PRIM_SOURCE No_buffer \
  CONFIG.RESET_PORT resetn \
  CONFIG.RESET_TYPE ACTIVE_LOW \
  CONFIG.USE_LOCKED false \
  CONFIG.USE_PHASE_ALIGNMENT false \
  CONFIG.USE_RESET true \
] [get_bd_cells sys_audio_clkgen]
create_bd_cell -type ip -vlnv xilinx.com:ip:system_ila:1.1 system_ila_0
set_property -dict [list \
  CONFIG.C_MON_TYPE NATIVE \
  CONFIG.C_NUM_OF_PROBES 13 \
  CONFIG.C_PROBE10_WIDTH 16 \
  CONFIG.C_PROBE11_WIDTH 16 \
  CONFIG.C_PROBE1_WIDTH 32 \
  CONFIG.C_PROBE3_WIDTH 32 \
  CONFIG.C_PROBE5_WIDTH 32 \
  CONFIG.C_PROBE7_WIDTH 32 \
  CONFIG.C_PROBE8_WIDTH 16 \
  CONFIG.C_PROBE9_WIDTH 16 \
  CONFIG.C_PROBE_WIDTH_PROPAGATION MANUAL \
] [get_bd_cells system_ila_0]
create_bd_cell -type ip -vlnv xilinx.com:user:wave_spi_new:1.0 wave_spi_new_0
create_bd_cell -type module -reference generic_iq_observer generic_iq_observer_0
set_property -dict {CONFIG.WARMUP_CYCLES 3} [get_bd_cells generic_iq_observer_0]
create_bd_cell -type ip -vlnv xilinx.com:ip:xlconcat:2.1 iq_enable_concat
set_property -dict {CONFIG.NUM_PORTS 4} [get_bd_cells iq_enable_concat]
create_bd_cell -type ip -vlnv xilinx.com:ip:ila:6.2 ila_generic_iq
set_property -dict [list \
  CONFIG.C_DATA_DEPTH 4096 \
  CONFIG.C_MONITOR_TYPE Native \
  CONFIG.C_NUM_OF_PROBES 14 \
  CONFIG.C_PROBE0_WIDTH 16 \
  CONFIG.C_PROBE10_WIDTH 4 \
  CONFIG.C_PROBE11_WIDTH 1 \
  CONFIG.C_PROBE12_WIDTH 1 \
  CONFIG.C_PROBE13_WIDTH 4 \
  CONFIG.C_PROBE1_WIDTH 16 \
  CONFIG.C_PROBE2_WIDTH 16 \
  CONFIG.C_PROBE3_WIDTH 16 \
  CONFIG.C_PROBE4_WIDTH 32 \
  CONFIG.C_PROBE5_WIDTH 1 \
  CONFIG.C_PROBE6_WIDTH 1 \
  CONFIG.C_PROBE7_WIDTH 1 \
  CONFIG.C_PROBE8_WIDTH 4 \
  CONFIG.C_PROBE9_WIDTH 2 \
] [get_bd_cells ila_generic_iq]
create_bd_cell -type ip -vlnv xilinx.com:ip:proc_sys_reset:5.0 dacfifo_axi_rstgen
set_property -dict {CONFIG.C_AUX_RESET_HIGH 0 CONFIG.C_EXT_RST_WIDTH 1} [get_bd_cells dacfifo_axi_rstgen]
create_bd_cell -type ip -vlnv xilinx.com:ip:clk_wiz:6.0 tx_ctrl_clkgen
set_property -dict [list \
  CONFIG.CLKOUT1_REQUESTED_OUT_FREQ 50 \
  CONFIG.PRIM_IN_FREQ 100 \
  CONFIG.PRIM_SOURCE No_buffer \
  CONFIG.RESET_TYPE ACTIVE_HIGH \
  CONFIG.USE_RESET true \
] [get_bd_cells tx_ctrl_clkgen]
create_bd_cell -type ip -vlnv xilinx.com:ip:proc_sys_reset:5.0 tx_ctrl_reset
create_bd_cell -type ip -vlnv xilinx.com:ip:axi_gpio:2.0 tx_control_gpio
set_property -dict [list \
  CONFIG.C_ALL_INPUTS_2 1 \
  CONFIG.C_ALL_OUTPUTS 1 \
  CONFIG.C_GPIO2_WIDTH 32 \
  CONFIG.C_GPIO_WIDTH 32 \
  CONFIG.C_IS_DUAL 1 \
] [get_bd_cells tx_control_gpio]
create_bd_cell -type ip -vlnv xilinx.com:ip:axi_gpio:2.0 tx_gt_status_gpio
set_property -dict {CONFIG.C_ALL_INPUTS 1 CONFIG.C_GPIO_WIDTH 32 CONFIG.C_IS_DUAL 0} [get_bd_cells tx_gt_status_gpio]
create_bd_cell -type ip -vlnv xilinx.com:ip:axi_bram_ctrl:4.1 tx_cfg_bram_ctrl
set_property -dict {CONFIG.DATA_WIDTH 32 CONFIG.SINGLE_PORT_BRAM 1} [get_bd_cells tx_cfg_bram_ctrl]
create_bd_cell -type ip -vlnv xilinx.com:ip:blk_mem_gen:8.4 tx_cfg_bram
set_property -dict [list \
  CONFIG.Assume_Synchronous_Clk false \
  CONFIG.EN_SAFETY_CKT false \
  CONFIG.Enable_B Use_ENB_Pin \
  CONFIG.Memory_Type True_Dual_Port_RAM \
  CONFIG.Read_Width_A 32 \
  CONFIG.Read_Width_B 32 \
  CONFIG.Register_PortB_Output_of_Memory_Core false \
  CONFIG.Register_PortB_Output_of_Memory_Primitives false \
  CONFIG.Write_Width_A 32 \
  CONFIG.Write_Width_B 32 \
] [get_bd_cells tx_cfg_bram]

# ---- hierarchy /axi_adrv9009_tx_jesd ----
current_bd_instance /axi_adrv9009_tx_jesd
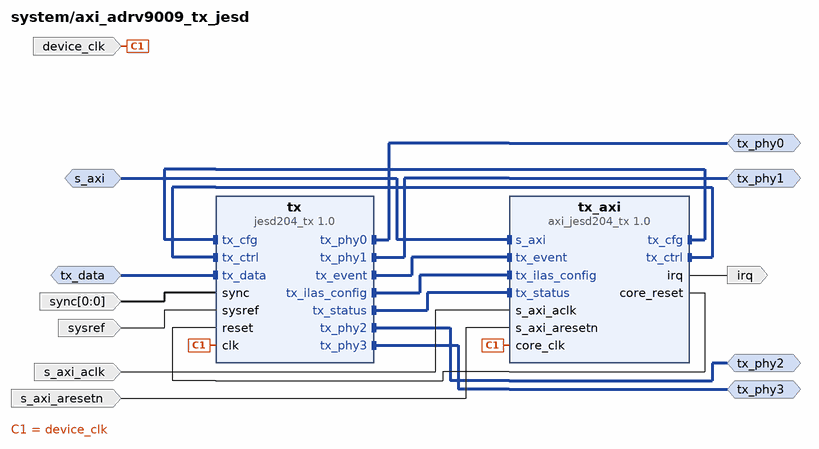
[diagram p7: block diagram inside /axi_adrv9009_tx_jesd]
create_bd_intf_pin -mode Slave -vlnv xilinx.com:interface:aximm_rtl:1.0 s_axi
create_bd_intf_pin -mode Slave -vlnv xilinx.com:interface:axis_rtl:1.0 tx_data
create_bd_intf_pin -mode Master -vlnv xilinx.com:display_jesd204:jesd204_tx_bus_rtl:1.0 tx_phy0
create_bd_intf_pin -mode Master -vlnv xilinx.com:display_jesd204:jesd204_tx_bus_rtl:1.0 tx_phy1
create_bd_intf_pin -mode Master -vlnv xilinx.com:display_jesd204:jesd204_tx_bus_rtl:1.0 tx_phy2
create_bd_intf_pin -mode Master -vlnv xilinx.com:display_jesd204:jesd204_tx_bus_rtl:1.0 tx_phy3
create_bd_pin -dir I -type clk s_axi_aclk
create_bd_pin -dir I -type rst s_axi_aresetn
create_bd_pin -dir O -type intr irq
create_bd_pin -dir I -type clk device_clk
create_bd_pin -dir I -from 0 -to 0 sync
create_bd_pin -dir I sysref

create_bd_cell -type ip -vlnv analog.com:user:jesd204_tx:1.0 tx
set_property -dict {CONFIG.NUM_LANES 4 CONFIG.NUM_LINKS 1} [get_bd_cells tx]
create_bd_cell -type ip -vlnv analog.com:user:axi_jesd204_tx:1.0 tx_axi
set_property -dict {CONFIG.NUM_LANES 4 CONFIG.NUM_LINKS 1} [get_bd_cells tx_axi]

# ---- hierarchy /tx_fir_interpolator ----
current_bd_instance /tx_fir_interpolator
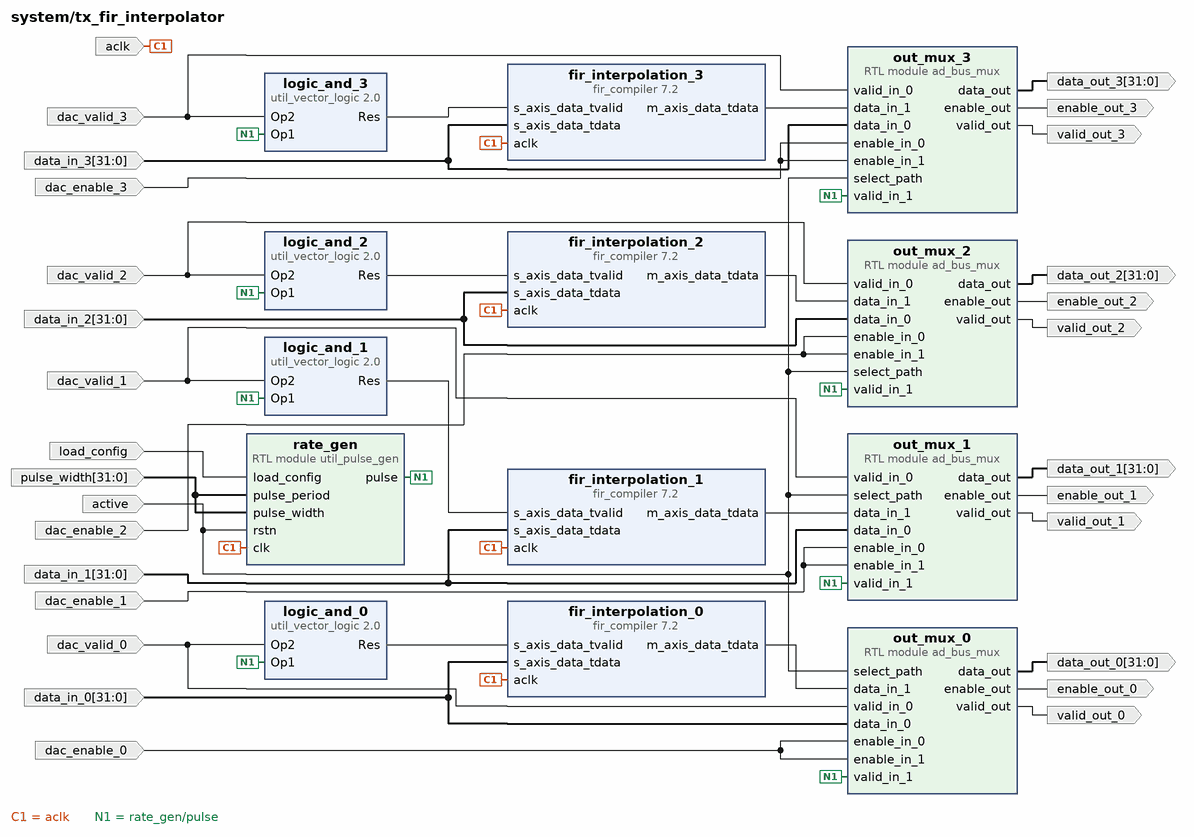
[diagram p8: block diagram inside /tx_fir_interpolator]
create_bd_pin -dir I aclk
create_bd_pin -dir I active
create_bd_pin -dir I -from 31 -to 0 pulse_width
create_bd_pin -dir I load_config
create_bd_pin -dir I dac_enable_0
create_bd_pin -dir O valid_out_0
create_bd_pin -dir O enable_out_0
create_bd_pin -dir I -from 31 -to 0 data_in_0
create_bd_pin -dir O -from 31 -to 0 data_out_0
create_bd_pin -dir I dac_valid_1
create_bd_pin -dir I dac_enable_1
create_bd_pin -dir O valid_out_1
create_bd_pin -dir O enable_out_1
create_bd_pin -dir I -from 31 -to 0 data_in_1
create_bd_pin -dir O -from 31 -to 0 data_out_1
create_bd_pin -dir I dac_valid_2
create_bd_pin -dir I dac_enable_2
create_bd_pin -dir O valid_out_2
create_bd_pin -dir O enable_out_2
create_bd_pin -dir I -from 31 -to 0 data_in_2
create_bd_pin -dir O -from 31 -to 0 data_out_2
create_bd_pin -dir I dac_valid_3
create_bd_pin -dir I dac_enable_3
create_bd_pin -dir O valid_out_3
create_bd_pin -dir O enable_out_3
create_bd_pin -dir I -from 31 -to 0 data_in_3
create_bd_pin -dir O -from 31 -to 0 data_out_3
create_bd_pin -dir I dac_valid_0

create_bd_cell -type module -reference ad_bus_mux out_mux_1
set_property -dict {CONFIG.DATA_WIDTH 32} [get_bd_cells out_mux_1]
create_bd_cell -type module -reference ad_bus_mux out_mux_2
set_property -dict {CONFIG.DATA_WIDTH 32} [get_bd_cells out_mux_2]
create_bd_cell -type module -reference ad_bus_mux out_mux_3
set_property -dict {CONFIG.DATA_WIDTH 32} [get_bd_cells out_mux_3]
create_bd_cell -type module -reference util_pulse_gen rate_gen
set_property -dict {CONFIG.PULSE_PERIOD 7 CONFIG.PULSE_WIDTH 1} [get_bd_cells rate_gen]
create_bd_cell -type module -reference ad_bus_mux out_mux_0
set_property -dict {CONFIG.DATA_WIDTH 32} [get_bd_cells out_mux_0]
create_bd_cell -type ip -vlnv xilinx.com:ip:fir_compiler:7.2 fir_interpolation_0
set_property -dict [list \
  CONFIG.Clock_Frequency 122.88 \
  CONFIG.CoefficientSource COE_File \
  CONFIG.Coefficient_File ../../../../../../../../../library/util_fir_int/coefile_int.coe \
  CONFIG.Coefficient_Fractional_Bits 0 \
  CONFIG.Coefficient_Sets 1 \
  CONFIG.Coefficient_Sign Signed \
  CONFIG.Coefficient_Structure Inferred \
  CONFIG.Coefficient_Width 16 \
  CONFIG.ColumnConfig 9 \
  CONFIG.Data_Fractional_Bits 15 \
  CONFIG.Decimation_Rate 1 \
  CONFIG.Filter_Architecture Systolic_Multiply_Accumulate \
  CONFIG.Filter_Type Interpolation \
  CONFIG.Interpolation_Rate 8 \
  CONFIG.Number_Channels 1 \
  CONFIG.Number_Paths 2 \
  CONFIG.Output_Rounding_Mode Symmetric_Rounding_to_Zero \
  CONFIG.Output_Width 16 \
  CONFIG.Quantization Integer_Coefficients \
  CONFIG.RateSpecification Frequency_Specification \
  CONFIG.Sample_Frequency 15.36 \
  CONFIG.Zero_Pack_Factor 1 \
] [get_bd_cells fir_interpolation_0]
create_bd_cell -type ip -vlnv xilinx.com:ip:fir_compiler:7.2 fir_interpolation_1
set_property -dict [list \
  CONFIG.Clock_Frequency 122.88 \
  CONFIG.CoefficientSource COE_File \
  CONFIG.Coefficient_File ../../../../../../../../../library/util_fir_int/coefile_int.coe \
  CONFIG.Coefficient_Fractional_Bits 0 \
  CONFIG.Coefficient_Sets 1 \
  CONFIG.Coefficient_Sign Signed \
  CONFIG.Coefficient_Structure Inferred \
  CONFIG.Coefficient_Width 16 \
  CONFIG.ColumnConfig 9 \
  CONFIG.Data_Fractional_Bits 15 \
  CONFIG.Decimation_Rate 1 \
  CONFIG.Filter_Architecture Systolic_Multiply_Accumulate \
  CONFIG.Filter_Type Interpolation \
  CONFIG.Interpolation_Rate 8 \
  CONFIG.Number_Channels 1 \
  CONFIG.Number_Paths 2 \
  CONFIG.Output_Rounding_Mode Symmetric_Rounding_to_Zero \
  CONFIG.Output_Width 16 \
  CONFIG.Quantization Integer_Coefficients \
  CONFIG.RateSpecification Frequency_Specification \
  CONFIG.Sample_Frequency 15.36 \
  CONFIG.Zero_Pack_Factor 1 \
] [get_bd_cells fir_interpolation_1]
create_bd_cell -type ip -vlnv xilinx.com:ip:fir_compiler:7.2 fir_interpolation_2
set_property -dict [list \
  CONFIG.Clock_Frequency 122.88 \
  CONFIG.CoefficientSource COE_File \
  CONFIG.Coefficient_File ../../../../../../../../../library/util_fir_int/coefile_int.coe \
  CONFIG.Coefficient_Fractional_Bits 0 \
  CONFIG.Coefficient_Sets 1 \
  CONFIG.Coefficient_Sign Signed \
  CONFIG.Coefficient_Structure Inferred \
  CONFIG.Coefficient_Width 16 \
  CONFIG.ColumnConfig 9 \
  CONFIG.Data_Fractional_Bits 15 \
  CONFIG.Decimation_Rate 1 \
  CONFIG.Filter_Architecture Systolic_Multiply_Accumulate \
  CONFIG.Filter_Type Interpolation \
  CONFIG.Interpolation_Rate 8 \
  CONFIG.Number_Channels 1 \
  CONFIG.Number_Paths 2 \
  CONFIG.Output_Rounding_Mode Symmetric_Rounding_to_Zero \
  CONFIG.Output_Width 16 \
  CONFIG.Quantization Integer_Coefficients \
  CONFIG.RateSpecification Frequency_Specification \
  CONFIG.Sample_Frequency 15.36 \
  CONFIG.Zero_Pack_Factor 1 \
] [get_bd_cells fir_interpolation_2]
create_bd_cell -type ip -vlnv xilinx.com:ip:fir_compiler:7.2 fir_interpolation_3
set_property -dict [list \
  CONFIG.Clock_Frequency 122.88 \
  CONFIG.CoefficientSource COE_File \
  CONFIG.Coefficient_File ../../../../../../../../../library/util_fir_int/coefile_int.coe \
  CONFIG.Coefficient_Fractional_Bits 0 \
  CONFIG.Coefficient_Sets 1 \
  CONFIG.Coefficient_Sign Signed \
  CONFIG.Coefficient_Structure Inferred \
  CONFIG.Coefficient_Width 16 \
  CONFIG.ColumnConfig 9 \
  CONFIG.Data_Fractional_Bits 15 \
  CONFIG.Decimation_Rate 1 \
  CONFIG.Filter_Architecture Systolic_Multiply_Accumulate \
  CONFIG.Filter_Type Interpolation \
  CONFIG.Interpolation_Rate 8 \
  CONFIG.Number_Channels 1 \
  CONFIG.Number_Paths 2 \
  CONFIG.Output_Rounding_Mode Symmetric_Rounding_to_Zero \
  CONFIG.Output_Width 16 \
  CONFIG.Quantization Integer_Coefficients \
  CONFIG.RateSpecification Frequency_Specification \
  CONFIG.Sample_Frequency 15.36 \
  CONFIG.Zero_Pack_Factor 1 \
] [get_bd_cells fir_interpolation_3]
create_bd_cell -type ip -vlnv xilinx.com:ip:util_vector_logic:2.0 logic_and_0
set_property -dict {CONFIG.C_SIZE 1} [get_bd_cells logic_and_0]
create_bd_cell -type ip -vlnv xilinx.com:ip:util_vector_logic:2.0 logic_and_1
set_property -dict {CONFIG.C_SIZE 1} [get_bd_cells logic_and_1]
create_bd_cell -type ip -vlnv xilinx.com:ip:util_vector_logic:2.0 logic_and_2
set_property -dict {CONFIG.C_SIZE 1} [get_bd_cells logic_and_2]
create_bd_cell -type ip -vlnv xilinx.com:ip:util_vector_logic:2.0 logic_and_3
set_property -dict {CONFIG.C_SIZE 1} [get_bd_cells logic_and_3]

# ---- hierarchy /tx_adrv9009_tpl_core ----
current_bd_instance /tx_adrv9009_tpl_core
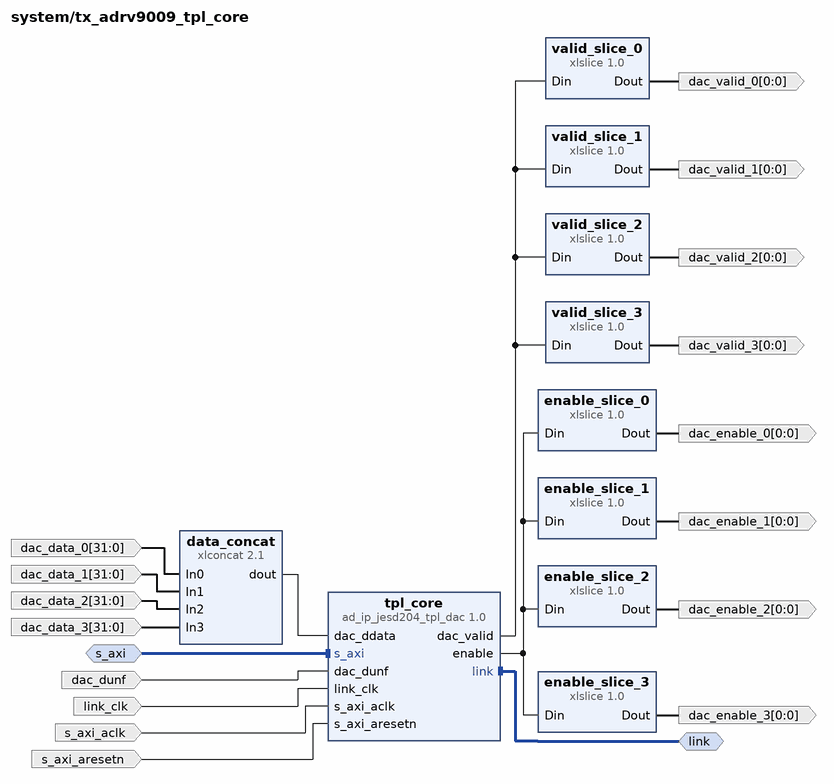
[diagram p9: block diagram inside /tx_adrv9009_tpl_core]
create_bd_intf_pin -mode Slave -vlnv xilinx.com:interface:aximm_rtl:1.0 s_axi
create_bd_intf_pin -mode Master -vlnv xilinx.com:interface:axis_rtl:1.0 link
create_bd_pin -dir I -type clk s_axi_aclk
create_bd_pin -dir I -type rst s_axi_aresetn
create_bd_pin -dir I -type clk link_clk
create_bd_pin -dir I dac_dunf
create_bd_pin -dir O -from 0 -to 0 dac_enable_0
create_bd_pin -dir O -from 0 -to 0 dac_valid_0
create_bd_pin -dir I -from 31 -to 0 dac_data_0
create_bd_pin -dir O -from 0 -to 0 dac_enable_1
create_bd_pin -dir O -from 0 -to 0 dac_valid_1
create_bd_pin -dir I -from 31 -to 0 dac_data_1
create_bd_pin -dir O -from 0 -to 0 dac_enable_2
create_bd_pin -dir O -from 0 -to 0 dac_valid_2
create_bd_pin -dir I -from 31 -to 0 dac_data_2
create_bd_pin -dir O -from 0 -to 0 dac_enable_3
create_bd_pin -dir O -from 0 -to 0 dac_valid_3
create_bd_pin -dir I -from 31 -to 0 dac_data_3

create_bd_cell -type ip -vlnv xilinx.com:ip:xlconcat:2.1 data_concat
set_property -dict {CONFIG.NUM_PORTS 4 CONFIG.dout_width 128} [get_bd_cells data_concat]
create_bd_cell -type ip -vlnv xilinx.com:ip:xlslice:1.0 enable_slice_0
set_property -dict {CONFIG.DIN_FROM 0 CONFIG.DIN_TO 0 CONFIG.DIN_WIDTH 4} [get_bd_cells enable_slice_0]
create_bd_cell -type ip -vlnv xilinx.com:ip:xlslice:1.0 enable_slice_1
set_property -dict {CONFIG.DIN_FROM 1 CONFIG.DIN_TO 1 CONFIG.DIN_WIDTH 4} [get_bd_cells enable_slice_1]
create_bd_cell -type ip -vlnv xilinx.com:ip:xlslice:1.0 enable_slice_2
set_property -dict {CONFIG.DIN_FROM 2 CONFIG.DIN_TO 2 CONFIG.DIN_WIDTH 4} [get_bd_cells enable_slice_2]
create_bd_cell -type ip -vlnv xilinx.com:ip:xlslice:1.0 enable_slice_3
set_property -dict {CONFIG.DIN_FROM 3 CONFIG.DIN_TO 3 CONFIG.DIN_WIDTH 4} [get_bd_cells enable_slice_3]
create_bd_cell -type ip -vlnv xilinx.com:ip:xlslice:1.0 valid_slice_0
set_property -dict {CONFIG.DIN_FROM 0 CONFIG.DIN_TO 0 CONFIG.DIN_WIDTH 4} [get_bd_cells valid_slice_0]
create_bd_cell -type ip -vlnv xilinx.com:ip:xlslice:1.0 valid_slice_1
set_property -dict {CONFIG.DIN_FROM 1 CONFIG.DIN_TO 1 CONFIG.DIN_WIDTH 4} [get_bd_cells valid_slice_1]
create_bd_cell -type ip -vlnv xilinx.com:ip:xlslice:1.0 valid_slice_2
set_property -dict {CONFIG.DIN_FROM 2 CONFIG.DIN_TO 2 CONFIG.DIN_WIDTH 4} [get_bd_cells valid_slice_2]
create_bd_cell -type ip -vlnv xilinx.com:ip:xlslice:1.0 valid_slice_3
set_property -dict {CONFIG.DIN_FROM 3 CONFIG.DIN_TO 3 CONFIG.DIN_WIDTH 4} [get_bd_cells valid_slice_3]
create_bd_cell -type ip -vlnv analog.com:user:ad_ip_jesd204_tpl_dac:1.0 tpl_core
set_property -dict [list \
  CONFIG.BITS_PER_SAMPLE 16 \
  CONFIG.CONVERTER_RESOLUTION 16 \
  CONFIG.NUM_CHANNELS 4 \
  CONFIG.NUM_LANES 4 \
  CONFIG.OCTETS_PER_BEAT 4 \
  CONFIG.SAMPLES_PER_FRAME 1 \
] [get_bd_cells tpl_core]

# ---- hierarchy /axi_adrv9009_rx_jesd ----
current_bd_instance /axi_adrv9009_rx_jesd
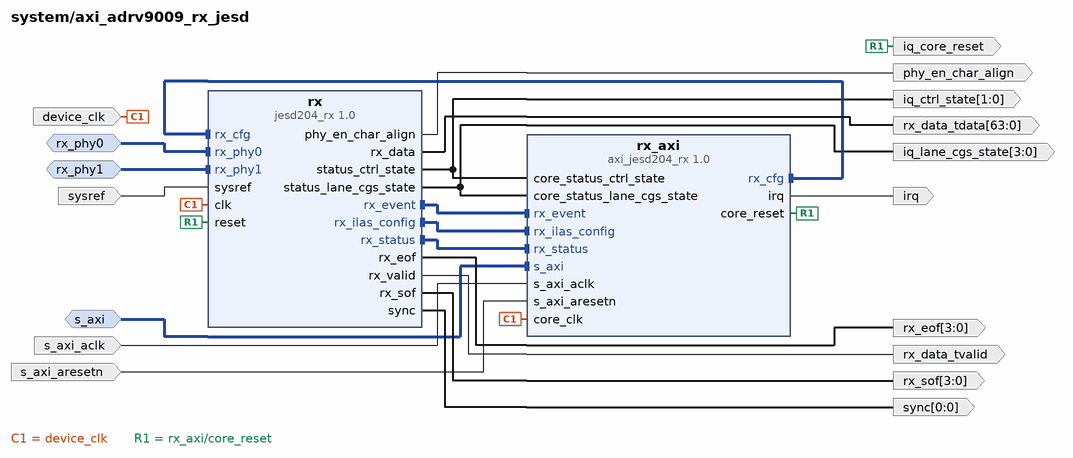
[diagram p10: block diagram inside /axi_adrv9009_rx_jesd]
create_bd_intf_pin -mode Slave -vlnv xilinx.com:interface:aximm_rtl:1.0 s_axi
create_bd_intf_pin -mode Slave -vlnv xilinx.com:display_jesd204:jesd204_rx_bus_rtl:1.0 rx_phy0
create_bd_intf_pin -mode Slave -vlnv xilinx.com:display_jesd204:jesd204_rx_bus_rtl:1.0 rx_phy1
create_bd_pin -dir I -type clk s_axi_aclk
create_bd_pin -dir I -type rst s_axi_aresetn
create_bd_pin -dir O -type intr irq
create_bd_pin -dir I -type clk device_clk
create_bd_pin -dir O -from 0 -to 0 sync
create_bd_pin -dir I sysref
create_bd_pin -dir O phy_en_char_align
create_bd_pin -dir O -from 3 -to 0 rx_eof
create_bd_pin -dir O -from 3 -to 0 rx_sof
create_bd_pin -dir O rx_data_tvalid
create_bd_pin -dir O -from 63 -to 0 rx_data_tdata
create_bd_pin -dir O -from 1 -to 0 iq_ctrl_state
create_bd_pin -dir O -from 3 -to 0 iq_lane_cgs_state
create_bd_pin -dir O iq_core_reset

create_bd_cell -type ip -vlnv analog.com:user:jesd204_rx:1.0 rx
set_property -dict {CONFIG.NUM_LANES 2 CONFIG.NUM_LINKS 1} [get_bd_cells rx]
create_bd_cell -type ip -vlnv analog.com:user:axi_jesd204_rx:1.0 rx_axi
set_property -dict {CONFIG.NUM_LANES 2 CONFIG.NUM_LINKS 1} [get_bd_cells rx_axi]

# ---- hierarchy /rx_adrv9009_tpl_core ----
current_bd_instance /rx_adrv9009_tpl_core
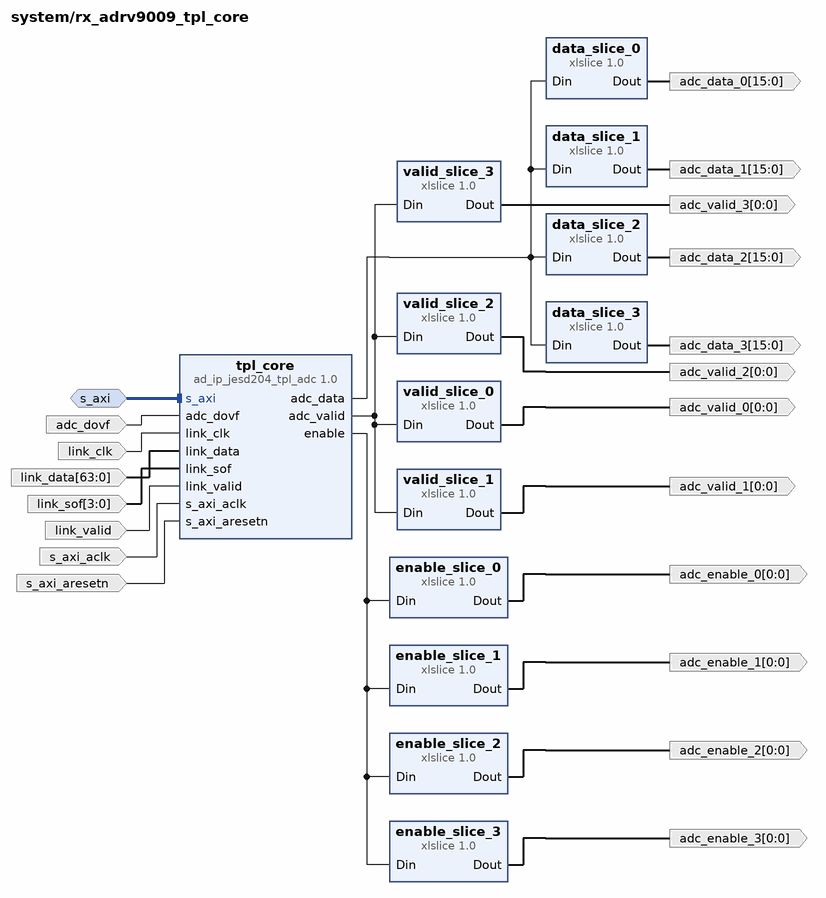
[diagram p11: block diagram inside /rx_adrv9009_tpl_core]
create_bd_intf_pin -mode Slave -vlnv xilinx.com:interface:aximm_rtl:1.0 s_axi
create_bd_pin -dir I -type clk s_axi_aclk
create_bd_pin -dir I -type rst s_axi_aresetn
create_bd_pin -dir I -type clk link_clk
create_bd_pin -dir I -from 3 -to 0 link_sof
create_bd_pin -dir I link_valid
create_bd_pin -dir I -from 63 -to 0 link_data
create_bd_pin -dir I adc_dovf
create_bd_pin -dir O -from 0 -to 0 adc_enable_0
create_bd_pin -dir O -from 0 -to 0 adc_valid_0
create_bd_pin -dir O -from 15 -to 0 adc_data_0
create_bd_pin -dir O -from 0 -to 0 adc_enable_1
create_bd_pin -dir O -from 0 -to 0 adc_valid_1
create_bd_pin -dir O -from 15 -to 0 adc_data_1
create_bd_pin -dir O -from 0 -to 0 adc_enable_2
create_bd_pin -dir O -from 0 -to 0 adc_valid_2
create_bd_pin -dir O -from 15 -to 0 adc_data_2
create_bd_pin -dir O -from 0 -to 0 adc_enable_3
create_bd_pin -dir O -from 0 -to 0 adc_valid_3
create_bd_pin -dir O -from 15 -to 0 adc_data_3

create_bd_cell -type ip -vlnv xilinx.com:ip:xlslice:1.0 data_slice_0
set_property -dict {CONFIG.DIN_FROM 15 CONFIG.DIN_TO 0 CONFIG.DIN_WIDTH 64 CONFIG.DOUT_WIDTH 16} [get_bd_cells data_slice_0]
create_bd_cell -type ip -vlnv xilinx.com:ip:xlslice:1.0 data_slice_1
set_property -dict {CONFIG.DIN_FROM 31 CONFIG.DIN_TO 16 CONFIG.DIN_WIDTH 64 CONFIG.DOUT_WIDTH 16} [get_bd_cells data_slice_1]
create_bd_cell -type ip -vlnv xilinx.com:ip:xlslice:1.0 data_slice_2
set_property -dict {CONFIG.DIN_FROM 47 CONFIG.DIN_TO 32 CONFIG.DIN_WIDTH 64} [get_bd_cells data_slice_2]
create_bd_cell -type ip -vlnv xilinx.com:ip:xlslice:1.0 data_slice_3
set_property -dict {CONFIG.DIN_FROM 63 CONFIG.DIN_TO 48 CONFIG.DIN_WIDTH 64} [get_bd_cells data_slice_3]
create_bd_cell -type ip -vlnv xilinx.com:ip:xlslice:1.0 enable_slice_0
set_property -dict {CONFIG.DIN_FROM 0 CONFIG.DIN_TO 0 CONFIG.DIN_WIDTH 4} [get_bd_cells enable_slice_0]
create_bd_cell -type ip -vlnv xilinx.com:ip:xlslice:1.0 enable_slice_1
set_property -dict {CONFIG.DIN_FROM 1 CONFIG.DIN_TO 1 CONFIG.DIN_WIDTH 4} [get_bd_cells enable_slice_1]
create_bd_cell -type ip -vlnv xilinx.com:ip:xlslice:1.0 enable_slice_2
set_property -dict {CONFIG.DIN_FROM 2 CONFIG.DIN_TO 2 CONFIG.DIN_WIDTH 4} [get_bd_cells enable_slice_2]
create_bd_cell -type ip -vlnv xilinx.com:ip:xlslice:1.0 enable_slice_3
set_property -dict {CONFIG.DIN_FROM 3 CONFIG.DIN_TO 3 CONFIG.DIN_WIDTH 4} [get_bd_cells enable_slice_3]
create_bd_cell -type ip -vlnv xilinx.com:ip:xlslice:1.0 valid_slice_0
set_property -dict {CONFIG.DIN_FROM 0 CONFIG.DIN_TO 0 CONFIG.DIN_WIDTH 4} [get_bd_cells valid_slice_0]
create_bd_cell -type ip -vlnv xilinx.com:ip:xlslice:1.0 valid_slice_1
set_property -dict {CONFIG.DIN_FROM 1 CONFIG.DIN_TO 1 CONFIG.DIN_WIDTH 4} [get_bd_cells valid_slice_1]
create_bd_cell -type ip -vlnv xilinx.com:ip:xlslice:1.0 valid_slice_2
set_property -dict {CONFIG.DIN_FROM 2 CONFIG.DIN_TO 2 CONFIG.DIN_WIDTH 4} [get_bd_cells valid_slice_2]
create_bd_cell -type ip -vlnv xilinx.com:ip:xlslice:1.0 valid_slice_3
set_property -dict {CONFIG.DIN_FROM 3 CONFIG.DIN_TO 3 CONFIG.DIN_WIDTH 4} [get_bd_cells valid_slice_3]
create_bd_cell -type ip -vlnv analog.com:user:ad_ip_jesd204_tpl_adc:1.0 tpl_core
set_property -dict [list \
  CONFIG.BITS_PER_SAMPLE 16 \
  CONFIG.CONVERTER_RESOLUTION 16 \
  CONFIG.NUM_CHANNELS 4 \
  CONFIG.NUM_LANES 2 \
  CONFIG.OCTETS_PER_BEAT 4 \
  CONFIG.SAMPLES_PER_FRAME 1 \
] [get_bd_cells tpl_core]

# ---- hierarchy /rx_fir_decimator ----
current_bd_instance /rx_fir_decimator
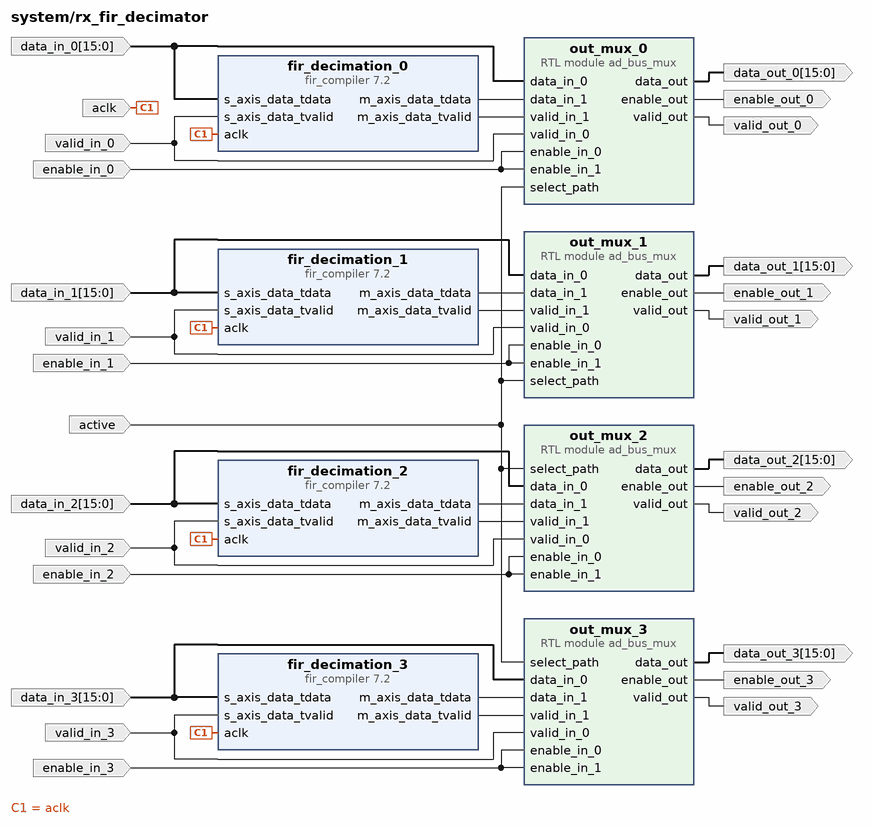
[diagram p12: block diagram inside /rx_fir_decimator]
create_bd_pin -dir I aclk
create_bd_pin -dir I active
create_bd_pin -dir I valid_in_0
create_bd_pin -dir I enable_in_0
create_bd_pin -dir O valid_out_0
create_bd_pin -dir O enable_out_0
create_bd_pin -dir I -from 15 -to 0 data_in_0
create_bd_pin -dir O -from 15 -to 0 data_out_0
create_bd_pin -dir I valid_in_1
create_bd_pin -dir I enable_in_1
create_bd_pin -dir O valid_out_1
create_bd_pin -dir O enable_out_1
create_bd_pin -dir I -from 15 -to 0 data_in_1
create_bd_pin -dir O -from 15 -to 0 data_out_1
create_bd_pin -dir I valid_in_2
create_bd_pin -dir I enable_in_2
create_bd_pin -dir O valid_out_2
create_bd_pin -dir O enable_out_2
create_bd_pin -dir I -from 15 -to 0 data_in_2
create_bd_pin -dir O -from 15 -to 0 data_out_2
create_bd_pin -dir I valid_in_3
create_bd_pin -dir I enable_in_3
create_bd_pin -dir O valid_out_3
create_bd_pin -dir O enable_out_3
create_bd_pin -dir I -from 15 -to 0 data_in_3
create_bd_pin -dir O -from 15 -to 0 data_out_3

create_bd_cell -type module -reference ad_bus_mux out_mux_0
set_property -dict {CONFIG.DATA_WIDTH 16} [get_bd_cells out_mux_0]
create_bd_cell -type module -reference ad_bus_mux out_mux_1
set_property -dict {CONFIG.DATA_WIDTH 16} [get_bd_cells out_mux_1]
create_bd_cell -type module -reference ad_bus_mux out_mux_2
set_property -dict {CONFIG.DATA_WIDTH 16} [get_bd_cells out_mux_2]
create_bd_cell -type module -reference ad_bus_mux out_mux_3
set_property -dict {CONFIG.DATA_WIDTH 16} [get_bd_cells out_mux_3]
create_bd_cell -type ip -vlnv xilinx.com:ip:fir_compiler:7.2 fir_decimation_0
set_property -dict [list \
  CONFIG.Clock_Frequency 122.88 \
  CONFIG.CoefficientSource COE_File \
  CONFIG.Coefficient_File ../../../../../../../../../library/util_fir_int/coefile_int.coe \
  CONFIG.Coefficient_Fractional_Bits 0 \
  CONFIG.Coefficient_Sets 1 \
  CONFIG.Coefficient_Sign Signed \
  CONFIG.Coefficient_Structure Inferred \
  CONFIG.Coefficient_Width 16 \
  CONFIG.ColumnConfig 9 \
  CONFIG.Data_Fractional_Bits 15 \
  CONFIG.Decimation_Rate 8 \
  CONFIG.Filter_Architecture Systolic_Multiply_Accumulate \
  CONFIG.Filter_Type Decimation \
  CONFIG.Interpolation_Rate 1 \
  CONFIG.Number_Channels 1 \
  CONFIG.Number_Paths 1 \
  CONFIG.Output_Rounding_Mode Symmetric_Rounding_to_Zero \
  CONFIG.Output_Width 16 \
  CONFIG.Quantization Integer_Coefficients \
  CONFIG.RateSpecification Frequency_Specification \
  CONFIG.Sample_Frequency 122.88 \
  CONFIG.Zero_Pack_Factor 1 \
] [get_bd_cells fir_decimation_0]
create_bd_cell -type ip -vlnv xilinx.com:ip:fir_compiler:7.2 fir_decimation_1
set_property -dict [list \
  CONFIG.Clock_Frequency 122.88 \
  CONFIG.CoefficientSource COE_File \
  CONFIG.Coefficient_File ../../../../../../../../../library/util_fir_int/coefile_int.coe \
  CONFIG.Coefficient_Fractional_Bits 0 \
  CONFIG.Coefficient_Sets 1 \
  CONFIG.Coefficient_Sign Signed \
  CONFIG.Coefficient_Structure Inferred \
  CONFIG.Coefficient_Width 16 \
  CONFIG.ColumnConfig 9 \
  CONFIG.Data_Fractional_Bits 15 \
  CONFIG.Decimation_Rate 8 \
  CONFIG.Filter_Architecture Systolic_Multiply_Accumulate \
  CONFIG.Filter_Type Decimation \
  CONFIG.Interpolation_Rate 1 \
  CONFIG.Number_Channels 1 \
  CONFIG.Number_Paths 1 \
  CONFIG.Output_Rounding_Mode Symmetric_Rounding_to_Zero \
  CONFIG.Output_Width 16 \
  CONFIG.Quantization Integer_Coefficients \
  CONFIG.RateSpecification Frequency_Specification \
  CONFIG.Sample_Frequency 122.88 \
  CONFIG.Zero_Pack_Factor 1 \
] [get_bd_cells fir_decimation_1]
create_bd_cell -type ip -vlnv xilinx.com:ip:fir_compiler:7.2 fir_decimation_2
set_property -dict [list \
  CONFIG.Clock_Frequency 122.88 \
  CONFIG.CoefficientSource COE_File \
  CONFIG.Coefficient_File ../../../../../../../../../library/util_fir_int/coefile_int.coe \
  CONFIG.Coefficient_Fractional_Bits 0 \
  CONFIG.Coefficient_Sets 1 \
  CONFIG.Coefficient_Sign Signed \
  CONFIG.Coefficient_Structure Inferred \
  CONFIG.Coefficient_Width 16 \
  CONFIG.ColumnConfig 9 \
  CONFIG.Data_Fractional_Bits 15 \
  CONFIG.Decimation_Rate 8 \
  CONFIG.Filter_Architecture Systolic_Multiply_Accumulate \
  CONFIG.Filter_Type Decimation \
  CONFIG.Interpolation_Rate 1 \
  CONFIG.Number_Channels 1 \
  CONFIG.Number_Paths 1 \
  CONFIG.Output_Rounding_Mode Symmetric_Rounding_to_Zero \
  CONFIG.Output_Width 16 \
  CONFIG.Quantization Integer_Coefficients \
  CONFIG.RateSpecification Frequency_Specification \
  CONFIG.Sample_Frequency 122.88 \
  CONFIG.Zero_Pack_Factor 1 \
] [get_bd_cells fir_decimation_2]
create_bd_cell -type ip -vlnv xilinx.com:ip:fir_compiler:7.2 fir_decimation_3
set_property -dict [list \
  CONFIG.Clock_Frequency 122.88 \
  CONFIG.CoefficientSource COE_File \
  CONFIG.Coefficient_File ../../../../../../../../../library/util_fir_int/coefile_int.coe \
  CONFIG.Coefficient_Fractional_Bits 0 \
  CONFIG.Coefficient_Sets 1 \
  CONFIG.Coefficient_Sign Signed \
  CONFIG.Coefficient_Structure Inferred \
  CONFIG.Coefficient_Width 16 \
  CONFIG.ColumnConfig 9 \
  CONFIG.Data_Fractional_Bits 15 \
  CONFIG.Decimation_Rate 8 \
  CONFIG.Filter_Architecture Systolic_Multiply_Accumulate \
  CONFIG.Filter_Type Decimation \
  CONFIG.Interpolation_Rate 1 \
  CONFIG.Number_Channels 1 \
  CONFIG.Number_Paths 1 \
  CONFIG.Output_Rounding_Mode Symmetric_Rounding_to_Zero \
  CONFIG.Output_Width 16 \
  CONFIG.Quantization Integer_Coefficients \
  CONFIG.RateSpecification Frequency_Specification \
  CONFIG.Sample_Frequency 122.88 \
  CONFIG.Zero_Pack_Factor 1 \
] [get_bd_cells fir_decimation_3]
